# EAGLE board Filter Board (EAGLE 9.5.1)
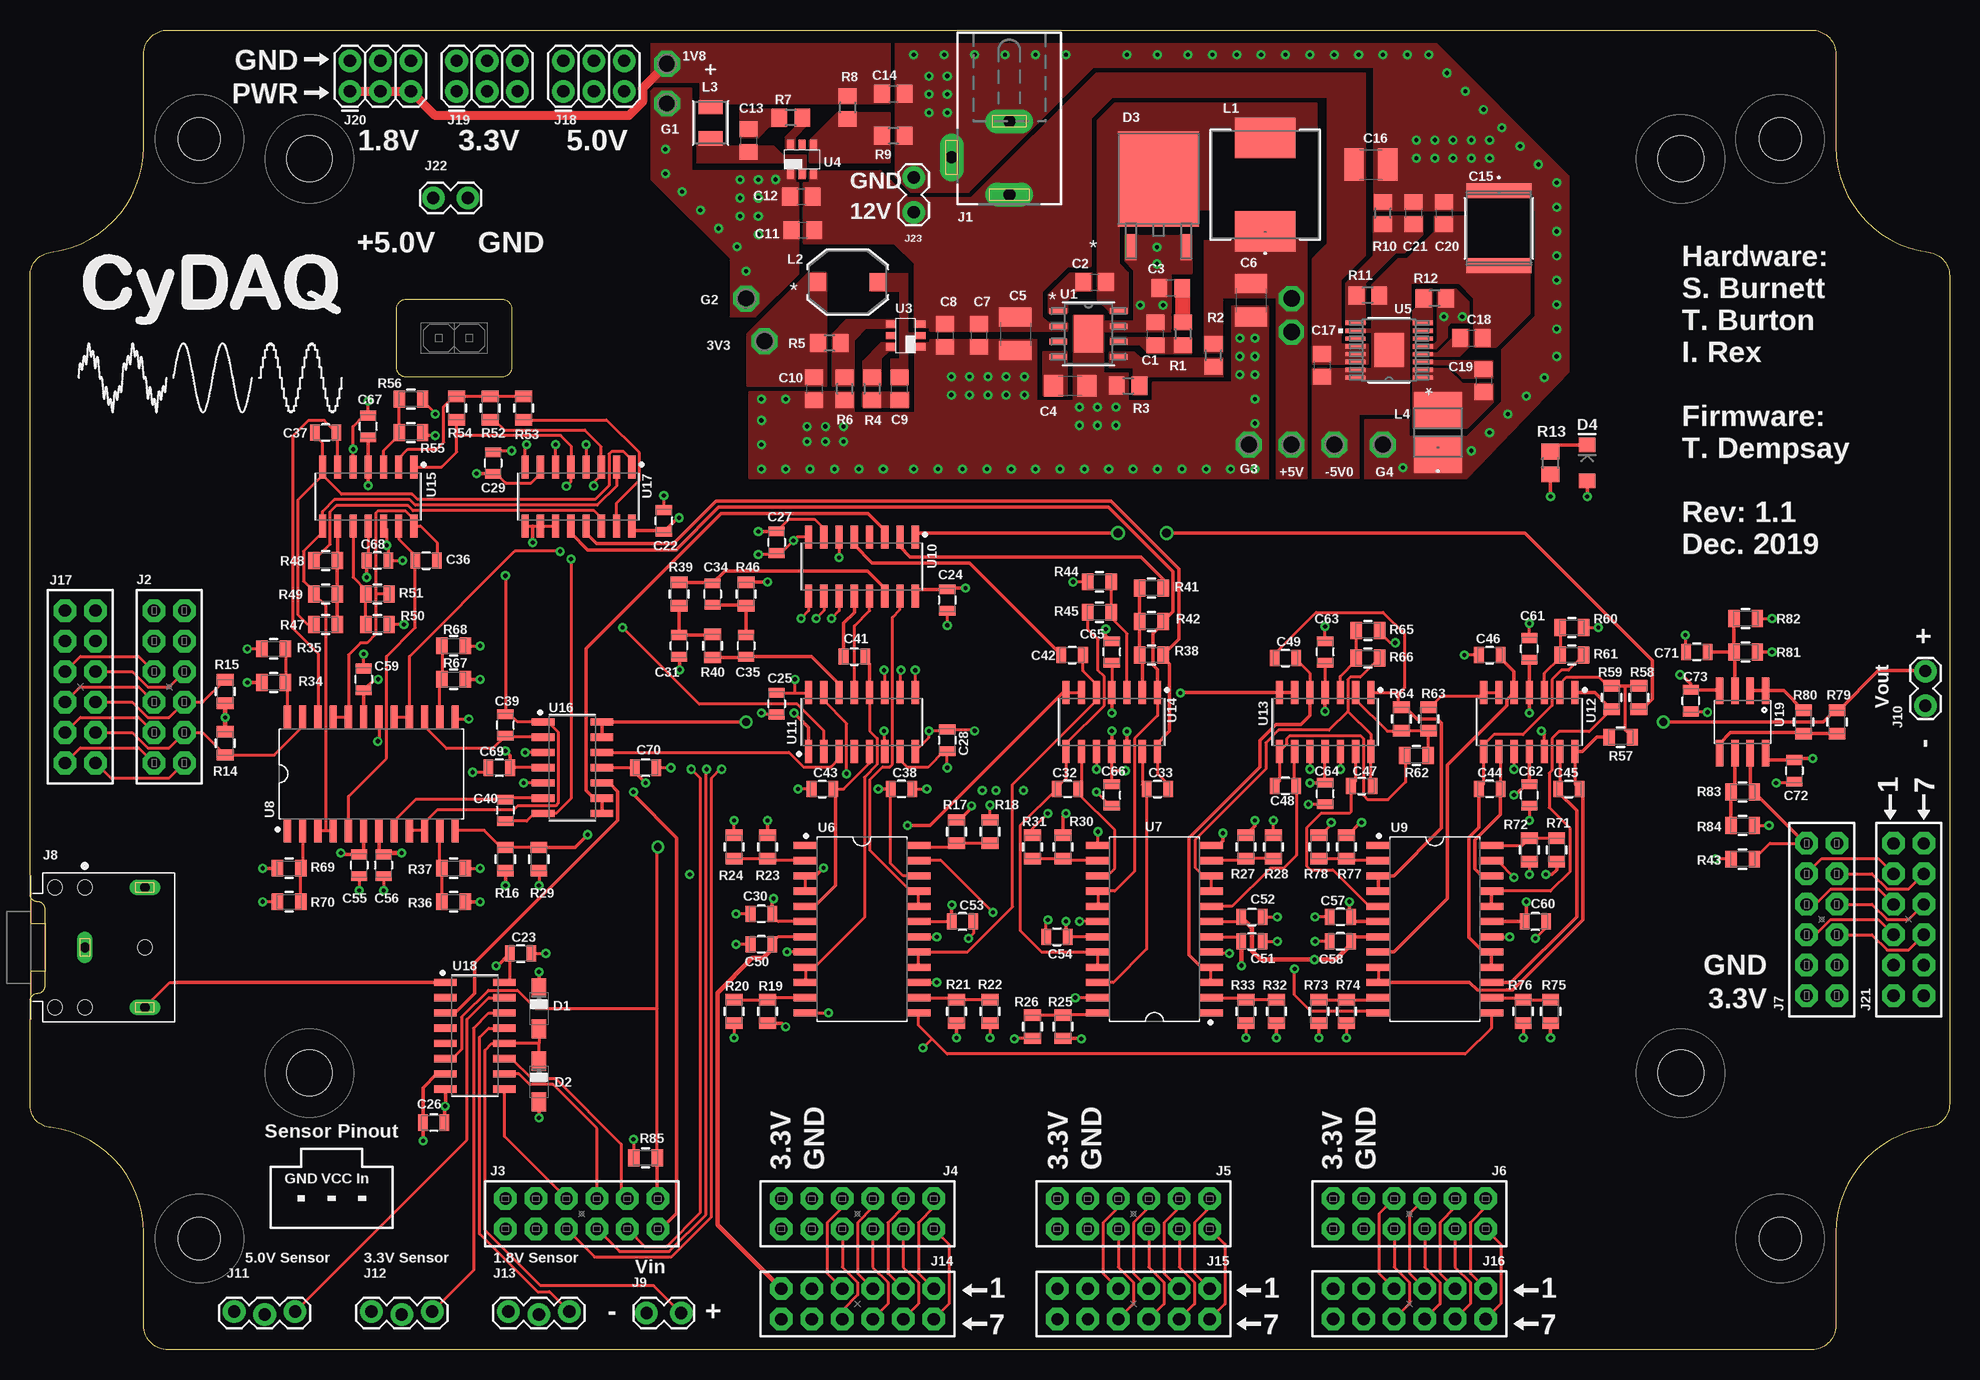
[diagram p5: board, top side]
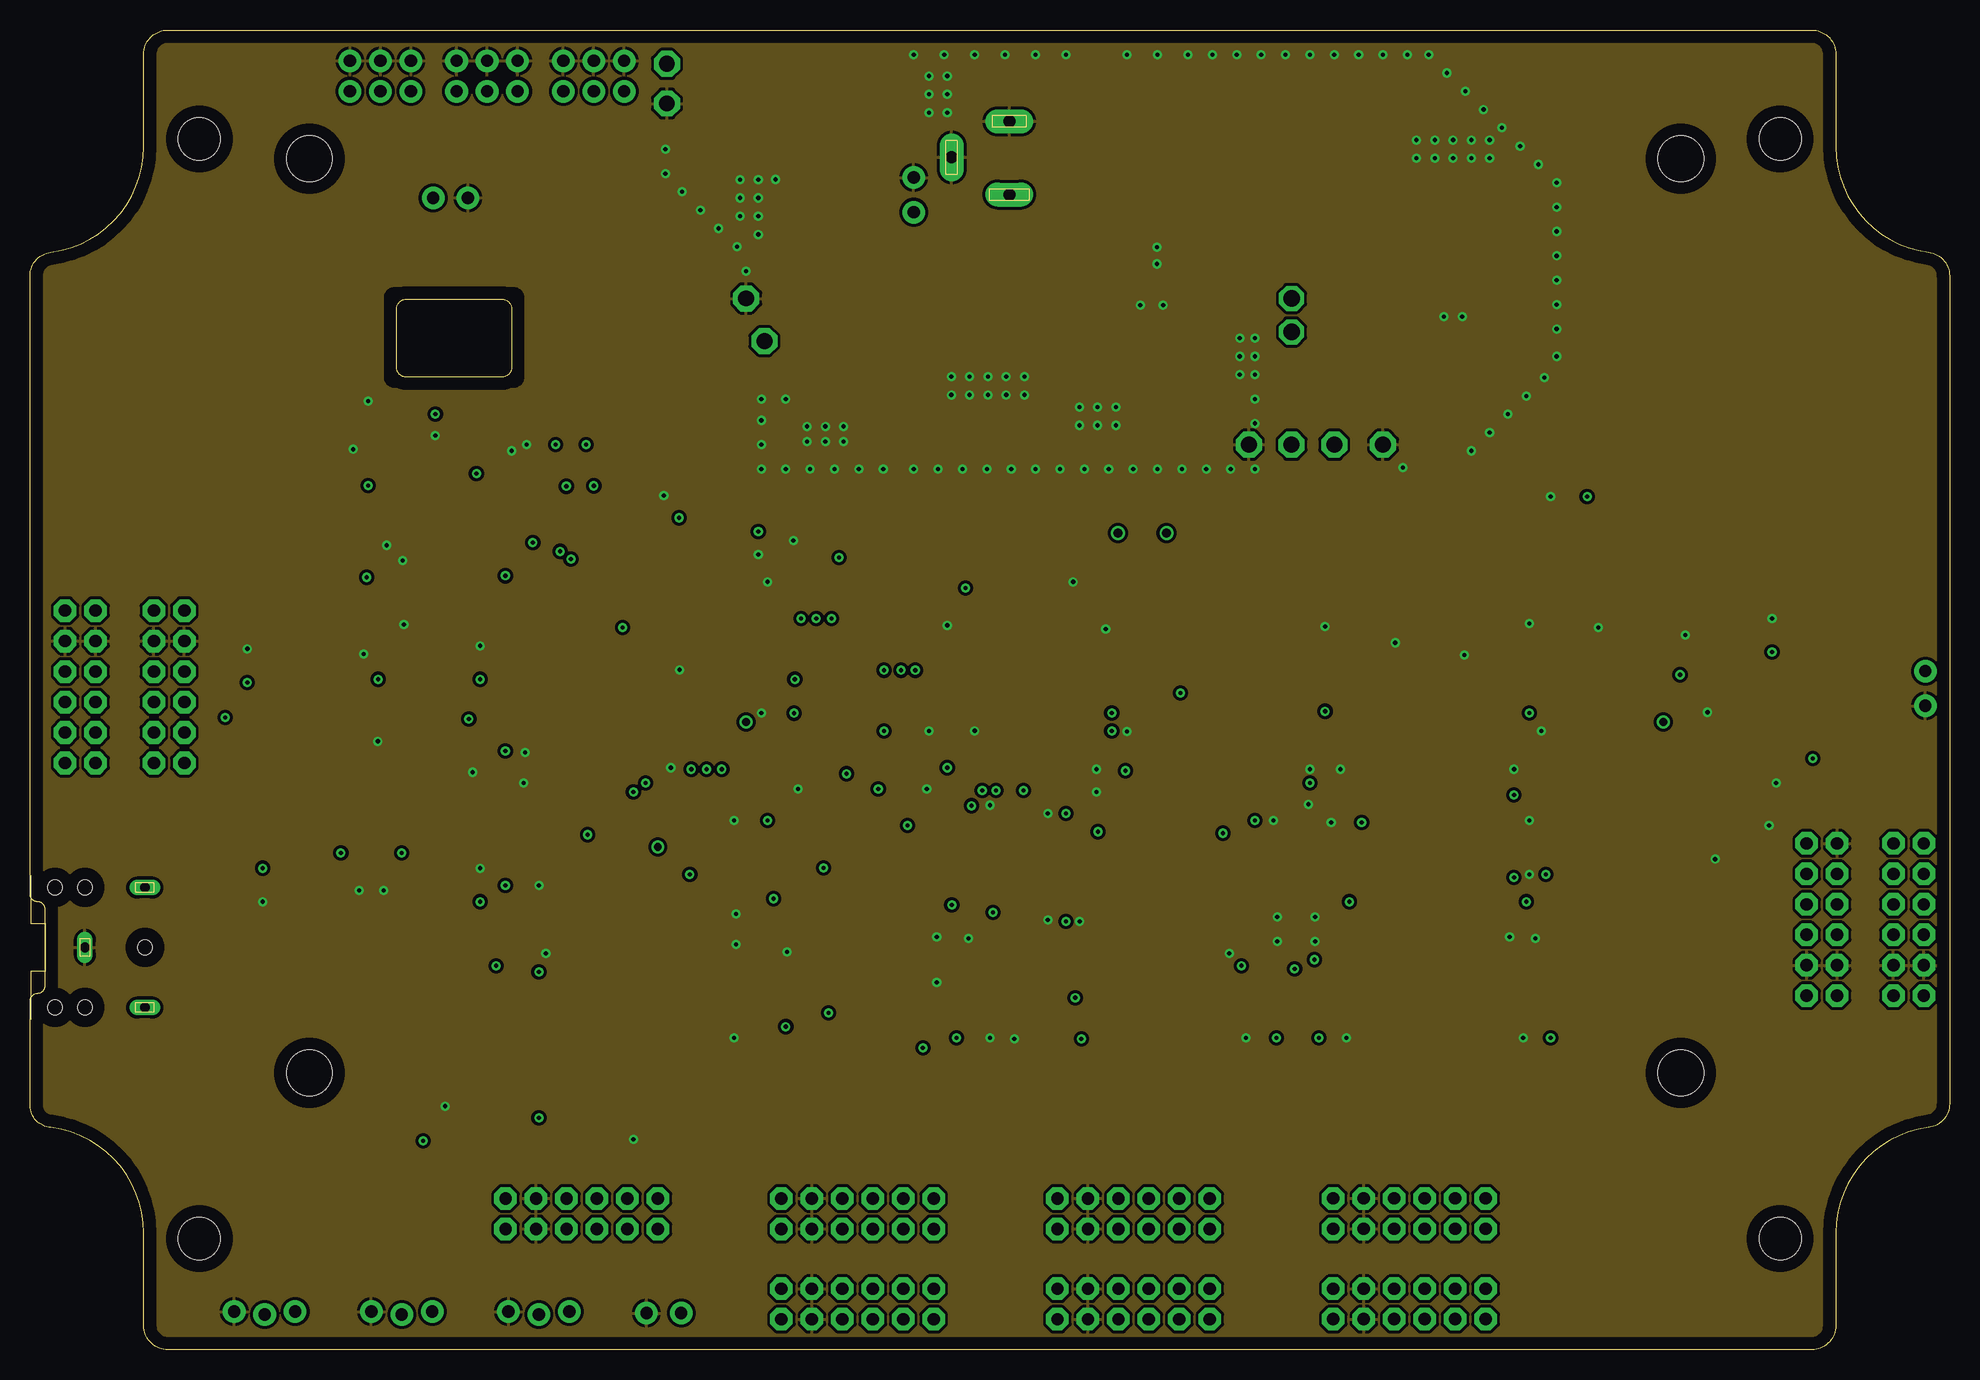
[diagram p6: board, inner layer Route2]
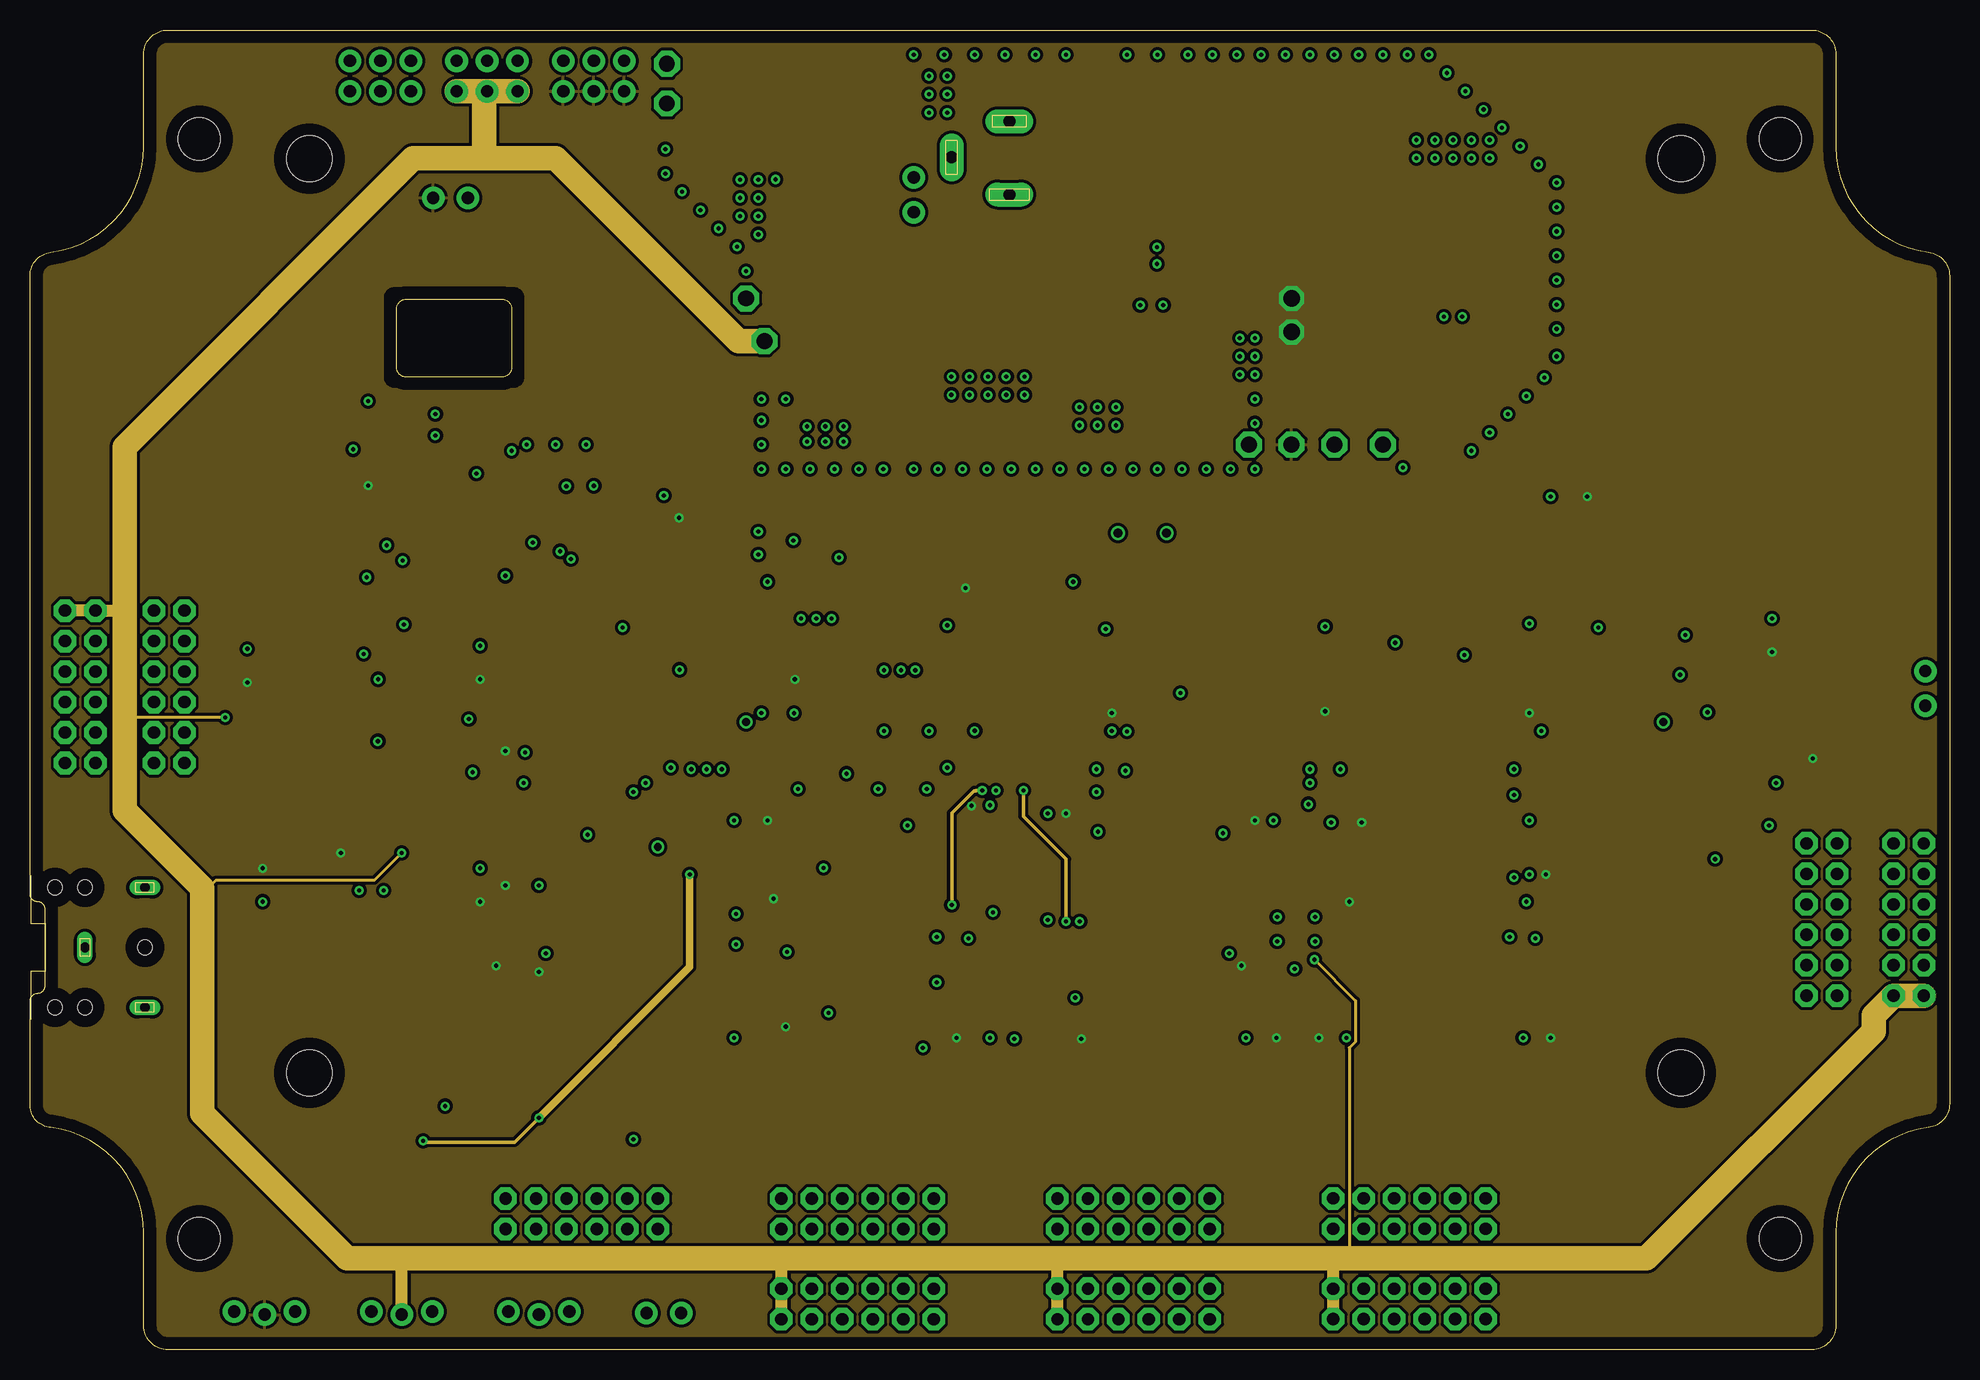
[diagram p7: board, inner layer Route15]
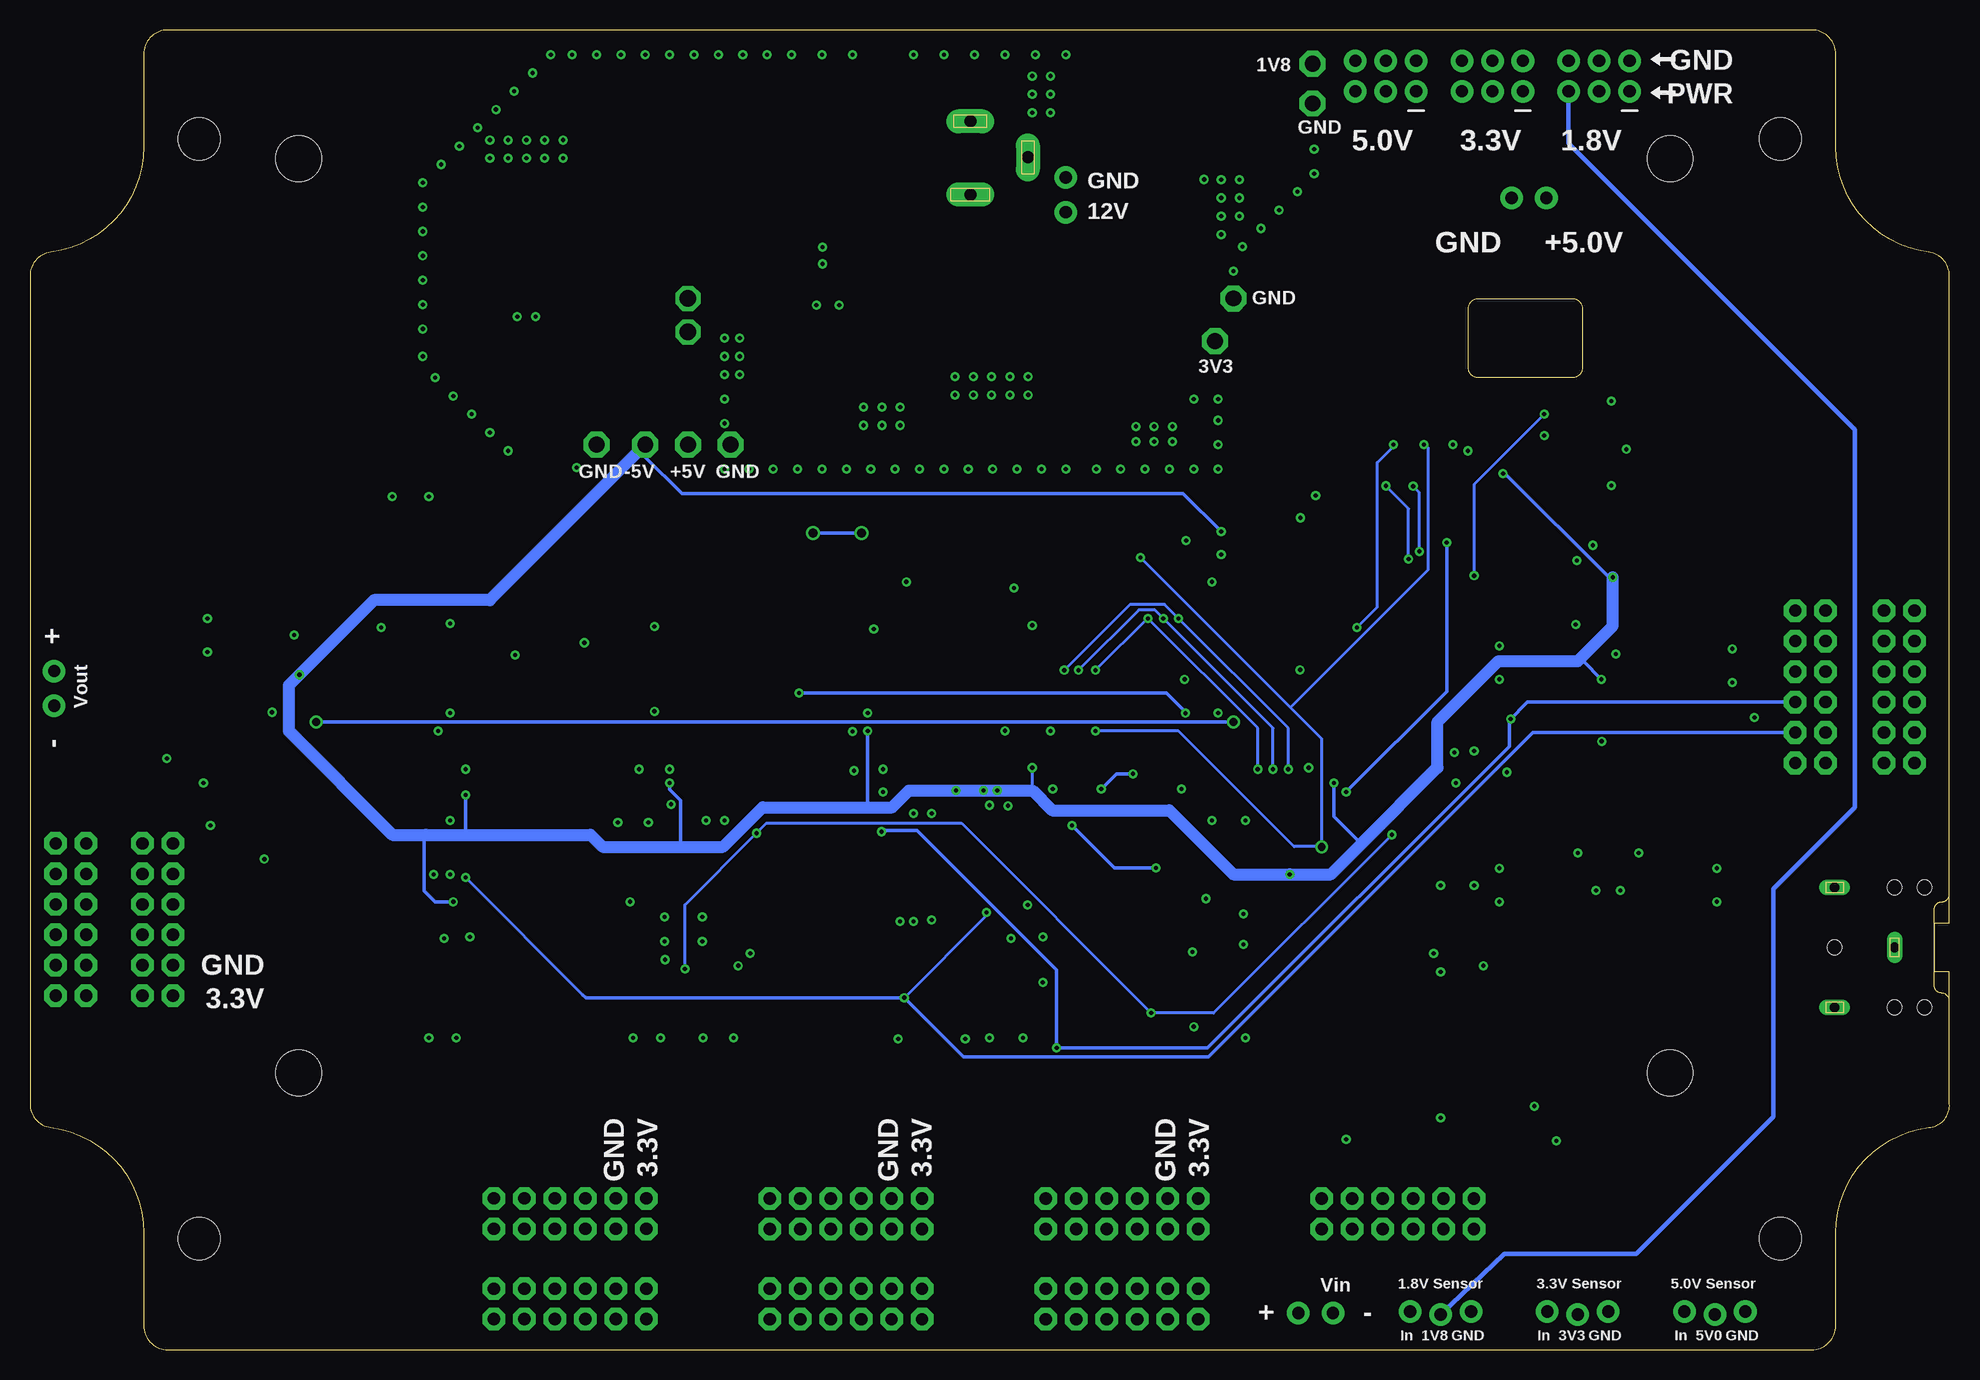
[diagram p8: board, bottom side, seen from below]

Size 160 x 110.01 mm. Coordinates in mm from the lower left corner, seen from the top.
Outline: 31.37,87.57 39.33,87.57 arc-90 40.14,86.75 40.14,81.88 arc-90 39.33,81.07 31.37,81.07 arc-90 30.56,81.88 30.56,86.75 arc-90 31.37,87.57
Outline: 0,29.08 arc-90 0.64,29.72 arc90 1.27,30.35 1.27,36.7 arc90 0.64,37.34 arc-90 0,37.97 0,89.51 arc-83 1.75,91.49 arc83 9.48,100.27 9.48,108.01 arc-90 11.48,110.01 148.52,110.01 arc-90 150.52,108.01 150.52,100.27 arc83 158.25,91.49 arc-83 160,89.51 160,20.5 arc-83 158.25,18.52 arc83 150.52,9.74 150.52,2 arc-90 148.52,0 11.48,0 arc-90 9.48,2 9.48,9.74 arc83 1.75,18.52 arc-90 0,20.5 0,29.08
Copper layers (1+2*15+16): Top 0.035mm / dielectric 1.5mm / Route2 0.035mm / dielectric 0.15mm / Route15 0.035mm / dielectric 0.2mm / Bottom 0.035mm
Design rules "default *": minimum track width 6mil, minimum drill 0.35mm, track to track 8mil, track to pad 8mil, pad to pad 8mil, via to via 8mil, smd to smd 6mil, copper to edge 40mil, drill to drill 6mil, minimum pad ring 10mil, minimum via ring 8mil, stop-mask expansion 4mil, vias tented up to drill 15mil, thermal gap 10mil
Net classes: 0 default: width 0.254 mm; 1 Power: width 0.254 mm, clearance 0.203 mm to class 0; 2 GND: width 0.254 mm, clearance 0.203 mm to class 0, clearance 0.254 mm to class 1
Holes 3.51 mm at 14.11,100.94 14.11,9.27 145.89,9.27 145.89,100.94
Holes 3.81 mm at 23.29,99.27 23.29,23.07 137.59,23.07 137.59,99.27

## Footprints (pad centres in the part's own frame; a part is rotated, then mirrored left to right if it is on the bottom)
P1-13 = drill 1.321 pad 2.159 octagon: TP 0,0
C0805 = smd 1.3 x 1.5: 1 -0.95,0; 2 0.95,0
C1206 = smd 1.6 x 1.8: 1 -1.4,0; 2 1.4,0
C1210 = smd 1.6 x 2.7: 1 -1.4,0; 2 1.4,0
CGA9N3X7R1_CAP_5750 = smd 1.25 x 5.41: 1 -3.124,0; 2 3.124,0
0805_H0.75 = smd 0.8 x 1.35: 1 -0.9,0; 2 0.9,0
SOD123 = smd 1.6 x 1.2: 1 -1.7,0; 2 1.7,0
DPAK-L = smd 0.889 x 2.184: 1 -2.29,-5.728; 3 2.29,-5.728 | smd 6.731 x 7.899: 2 0,-0.051
LED-1206 = smd 1.2 x 1.4: A -1.5,0; C 1.5,0
DCJ0202 = drill 1 pad 2 long: 1 0,3.1; 2 4.8,0; 3 0,-3
FEMALE_HEADER-2X6 = drill 1.016 pad 1.88 octagon: 1 0,0; 2 0,2.54; 3 2.54,0; 4 2.54,2.54; 5 5.08,0; 6 5.08,2.54; 7 7.62,0; 8 7.62,2.54; 9 10.16,0; 10 10.16,2.54; 11 12.7,0; 12 12.7,2.54
CUI_SJ1-3523N = drill 0.8 long: 1 0,0; 2 5,-5; 3 5,5 | hole 1.2: -2.5,5; 0,5; 5,0; -2.5,-5; 0,-5
1X02_LOCK = drill 1.016 pad 1.88: 1 -0.178,0; 2 2.718,0
1X03_LOCK = drill 1.016 pad 1.88: 1 0,0.127; 2 2.54,-0.127; 3 5.08,0.127
2X3 = drill 1.016 pad 1.88: 1 0,0; 2 0,2.54; 3 2.54,0; 4 2.54,2.54; 5 5.08,0; 6 5.08,2.54
IHLP-3232DZ_IND_IHLP-3232DZ = smd 3.4 x 5.055: 1 -3.891,0; 2 3.891,0
IND_5022 = smd 1.45 x 1.5: 1 -2.525,0; 2 2.525,0
IND_NLCV32TR = smd 1.194 x 2.007: 1 -1.295,0; 2 1.295,0
IFSC-1515A_IND_IFSC_1515AH = smd 3.007 x 4.013: 1 -1.859,0; 2 1.859,0
R0805 = smd 1.3 x 1.5: 1 -0.95,0; 2 0.95,0
0805 = smd 0.95 x 1.4: 1 -0.975,0; 2 0.975,0
DDA8_3P1X2P4-L = smd 1.473 x 0.483: 1 -2.515,1.905; 2 -2.515,0.635; 3 -2.515,-0.635; 4 -2.515,-1.905; 5 2.515,-1.905; 6 2.515,-0.635; 7 2.515,0.635; 8 2.515,1.905 | smd 2.4 x 3.1: EPAD 0,0
TSOT23-6_DDC = smd 0.6 x 0.8: 1 -0.95,-1.25; 2 0,-1.25; 3 0.95,-1.25; 4 0.95,1.25; 5 0,1.25; 6 -0.95,1.25
PWP16 = smd 1.676 x 0.356: 1 -2.819,2.275; 2 -2.819,1.625; 3 -2.819,0.975; 4 -2.819,0.325; 5 -2.819,-0.325; 6 -2.819,-0.975; 7 -2.819,-1.625; 8 -2.819,-2.275; 9 2.819,-2.275; 10 2.819,-1.625; 11 2.819,-0.975; 12 2.819,-0.325; 13 2.819,0.325; 14 2.819,0.975; 15 2.819,1.625; 16 2.819,2.275 | smd 2.464 x 2.819: 17 0,0
SOIC127P1030X250-25T200X300 = smd 2 x 0.6: 1 -4.705,6.985; 2 -4.705,5.715; 3 -4.705,4.445; 4 -4.705,3.175; 5 -4.705,1.905; 6 -4.705,0.635; 7 -4.705,-0.635; 8 -4.705,-1.905; 9 -4.705,-3.175; 10 -4.705,-4.445; 11 -4.705,-5.715; 12 -4.705,-6.985; 13 4.705,-6.985; 14 4.705,-5.715; 15 4.705,-4.445; 16 4.705,-3.175; 17 4.705,-1.905; 18 4.705,-0.635; 19 4.705,0.635; 20 4.705,1.905; 21 4.705,3.175; 22 4.705,4.445; 23 4.705,5.715; 24 4.705,6.985
SOIC127P600X144-16 = smd 1.901 x 0.599: 1 -2.455,4.445; 2 -2.455,3.175; 3 -2.455,1.905; 4 -2.455,0.635; 5 -2.455,-0.635; 6 -2.455,-1.905; 7 -2.455,-3.175; 8 -2.455,-4.445; 9 2.455,-4.445; 10 2.455,-3.175; 11 2.455,-1.905; 12 2.455,-0.635; 13 2.455,0.635; 14 2.455,1.905; 15 2.455,3.175; 16 2.455,4.445
SOIC127P600X144-14 = smd 1.901 x 0.599: 1 -2.455,3.81; 2 -2.455,2.54; 3 -2.455,1.27; 4 -2.455,0; 5 -2.455,-1.27; 6 -2.455,-2.54; 7 -2.455,-3.81; 8 2.455,-3.81; 9 2.455,-2.54; 10 2.455,-1.27; 11 2.455,0; 12 2.455,1.27; 13 2.455,2.54; 14 2.455,3.81
SO08 = smd 0.61 x 2.21: 1 -1.905,-2.616; 2 -0.635,-2.616; 3 0.635,-2.616; 4 1.905,-2.616; 5 1.905,2.616; 6 0.635,2.616; 7 -0.635,2.616; 8 -1.905,2.616

## Placement (x,y rotation side)
1V8  TPPAD1-13  [P1-13]  53.09,107.19 0 top
3V3  TPPAD1-13  [P1-13]  61.22,84.07 0 top
+5V  TPPAD1-13  [P1-13]  105.16,75.44 0 top
-5V0  TPPAD1-13  [P1-13]  108.71,75.44 0 top
C1  10pF  [C0805]  93.82,84.67 90 top
C2  100nF  [C0805]  88.74,88.99 0 top
C3  1.2nF  [C0805]  95.09,88.48 180 top
C4  8.2nF  [C1206]  86.71,80.35 0 top
C5  10uF  [C1210]  82.13,84.67 270 top
C6  47uF  [C1210]  101.77,87.46 270 top
C7  10uF  [C0805]  79.09,84.54 270 top
C8  100nF  [C0805]  76.29,84.54 270 top
C9  100nF  [C0805]  72.48,80.1 90 top
C10  22uF  [C0805]  65.37,80.1 270 top
C11  10uF  [C0805]  64.43,93.31 180 top
C12  100nF  [C0805]  64.3,96.1 180 top
C13  100nF  [C0805]  59.91,100.8 270 top
C14  22uF  [C0805]  71.97,104.69 0 top
C15  47uF  [CGA9N3X7R1_CAP_5750]  122.43,93.47 270 top
C16  22uF  [C1210]  111.76,98.81 0 top
C17  4.7uF  [C0805]  107.7,82.04 270 top
C18  2.2uF  [C0805]  120.14,84.33 0 top
C19  [C0805]  121.16,80.77 270 top
C20  4.7uF  [C0805]  117.86,94.74 270 top
C21  33pF  [C0805]  115.32,94.74 270 top
C22  0.1uF  [0805_H0.75]  52.83,69.09 90 top
C23  0.1uF  [0805_H0.75]  40.9,33.02 0 top
C24  0.1uF  [0805_H0.75]  76.46,62.48 270 top
C25  0.1uF  [0805_H0.75]  62.23,53.85 270 top
C26  0.1uF  [0805_H0.75]  33.66,18.92 180 top
C27  0.1uF  [0805_H0.75]  62.23,67.31 270 top
C28  0.1uF  [0805_H0.75]  76.46,50.8 270 top
C29  0.1uF  [0805_H0.75]  38.61,73.91 270 top
C30  0.1uF  [0805_H0.75]  60.96,36.32 180 top
C31  0.1uF  [0805_H0.75]  54.1,58.67 90 top
C32  10nF  [0805_H0.75]  86.49,46.74 180 top
C33  10nF  [0805_H0.75]  93.98,46.74 0 top
C34  0.1uF  [0805_H0.75]  56.9,62.99 270 top
C35  0.1uF  [0805_H0.75]  59.69,58.67 270 top
C36  10nF  [0805_H0.75]  33.02,65.79 0 top
C37  10nF  [0805_H0.75]  24.64,76.45 180 top
C38  10nF  [0805_H0.75]  72.65,46.74 180 top
C39  10nF  [0805_H0.75]  39.63,52.07 90 top
C40  10nF  [0805_H0.75]  39.63,44.96 270 top
C41  10nF  [0805_H0.75]  68.71,57.78 0 top
C42  10nF  [0805_H0.75]  86.87,57.91 0 top
C43  10nF  [0805_H0.75]  66.04,46.74 0 top
C44  10nF  [0805_H0.75]  121.67,46.74 180 top
C45  10nF  [0805_H0.75]  128.27,46.74 0 top
C46  10nF  [0805_H0.75]  121.67,57.91 0 top
C47  10nF  [0805_H0.75]  111,46.99 0 top
C48  10nF  [0805_H0.75]  104.65,46.99 180 top
C49  10nF  [0805_H0.75]  104.65,57.66 0 top
C50  0.1uF  [0805_H0.75]  60.96,33.78 180 top
C51  0.1uF  [0805_H0.75]  101.86,34.04 0 top
C52  0.1uF  [0805_H0.75]  101.86,36.07 0 top
C53  0.1uF  [0805_H0.75]  77.73,35.69 180 top
C54  0.1uF  [0805_H0.75]  85.6,34.42 0 top
C55  0.1uF  [0805_H0.75]  27.43,40.39 270 top
C56  0.1uF  [0805_H0.75]  29.47,40.39 270 top
C57  0.1uF  [0805_H0.75]  109.22,36.07 180 top
C58  0.1uF  [0805_H0.75]  109.22,34.04 180 top
C59  0.1uF  [0805_H0.75]  27.82,55.88 270 top
C60  0.1uF  [0805_H0.75]  125.48,35.69 180 top
C61  0.1uF  [0805_H0.75]  124.97,58.42 90 top
C62  0.1uF  [0805_H0.75]  124.97,46.23 90 top
C63  0.1uF  [0805_H0.75]  107.95,58.17 90 top
C64  0.1uF  [0805_H0.75]  107.95,46.35 90 top
C65  0.1uF  [0805_H0.75]  90.17,58.17 90 top
C66  0.1uF  [0805_H0.75]  90.17,46.23 90 top
C67  0.1uF  [0805_H0.75]  28.2,76.96 90 top
C68  0.1uF  [0805_H0.75]  28.96,65.79 180 top
C69  0.1uF  [0805_H0.75]  39.12,48.51 180 top
C70  0.1uF  [0805_H0.75]  51.31,48.51 180 top
C71  0.01uF  [0805_H0.75]  138.94,58.17 180 top
C72  0.1uF  [0805_H0.75]  147.07,48.26 270 top
C73  0.1uF  [0805_H0.75]  138.43,54.1 90 top
D1  SBR80520LT3G  [SOD123]  42.42,28.45 270 top
D2  SBR80520LT3G  [SOD123]  42.42,22.35 270 top
D3  VS-50WQ04FNPBFDPAK-L  [DPAK-L]  94.07,97.62 0 top
D4  GREEN  [LED-1206]  129.8,73.91 90 top
G1  TPPAD1-13  [P1-13]  53.09,103.89 0 top
G2  TPPAD1-13  [P1-13]  59.69,87.63 0 top
G3  TPPAD1-13  [P1-13]  101.6,75.44 0 top
G4  TPPAD1-13  [P1-13]  112.78,75.44 0 top
J1  DCJ0202  [DCJ0202]  81.63,99.4 180 top
J2  ZYBO_JF  [FEMALE_HEADER-2X6]  10.33,61.61 270 top
J3  ZYBO_JE  [FEMALE_HEADER-2X6]  39.64,10.06 0 top
J4  ZYBO_JD  [FEMALE_HEADER-2X6]  62.63,10.06 0 top
J5  ZYBO_JC  [FEMALE_HEADER-2X6]  85.64,10.06 0 top
J6  ZYBO_JB  [FEMALE_HEADER-2X6]  108.63,10.06 0 top
J7  A_XADC  [FEMALE_HEADER-2X6]  150.63,29.51 90 top
J8  SJ1-3523N  [CUI_SJ1-3523N]  4.57,33.53 0 top
J9  Vin_HEADER  [1X02_LOCK]  51.56,3.05 0 top
J10  Vout_HEADER  [1X02_LOCK]  157.99,56.39 270 top
J11  5V0_SENSOR  [1X03_LOCK]  17.02,3.05 0 top
J12  3V3_SENSOR  [1X03_LOCK]  28.45,3.05 0 top
J13  1V8_SENSOR  [1X03_LOCK]  39.88,3.05 0 top
J14  BRKOUT_JD  [FEMALE_HEADER-2X6]  62.63,2.54 0 top
J15  BRKOUT_JC  [FEMALE_HEADER-2X6]  85.64,2.54 0 top
J16  BRKOUT_JB  [FEMALE_HEADER-2X6]  108.63,2.55 0 top
J17  BRKOUT_JF  [FEMALE_HEADER-2X6]  2.92,61.61 270 top
J18  5V0_CONN  [2X3]  44.45,104.9 0 top
J19  3V3_CONN  [2X3]  35.56,104.9 0 top
J20  1V8_CONN  [2X3]  26.67,104.9 0 top
J21  BRKOUT_JD  [FEMALE_HEADER-2X6]  157.87,29.51 90 top
J22  ZYBO_Power  [1X02_LOCK]  36.32,96.01 180 top
J23  INPUT_PWR  [1X02_LOCK]  73.66,97.54 270 top
L1  IHLP-3232DZ_IHLP3232DZER4R7M11  [IHLP-3232DZ_IND_IHLP-3232DZ]  102.96,97.12 90 top
L2  4.7uH  [IND_5022]  68.16,88.99 0 top
L3  2.2uH  [IND_NLCV32TR]  56.73,102.27 270 top
L4  15uH  [IFSC-1515A_IND_IFSC_1515AH]  117.35,76.45 90 top
R1  [R0805]  96.1,84.67 270 top
R2  [R0805]  98.64,82.89 90 top
R3  [R0805]  91.53,80.35 0 top
R4  30  [R0805]  70.2,80.1 270 top
R5  30.9k  [R0805]  66.64,83.91 180 top
R6  10k  [R0805]  67.91,80.1 90 top
R7  30  [R0805]  63.41,102.7 180 top
R8  12.4k  [R0805]  68.16,103.54 90 top
R9  10k  [R0805]  71.97,101.18 180 top
R10  1000k  [R0805]  112.78,94.74 90 top
R11  255k  [R0805]  111.51,87.88 180 top
R12  100k  [R0805]  117.1,87.63 180 top
R13  470  [R0805]  126.75,73.91 90 top
R14  4.7k  [0805]  16.26,50.55 90 top
R15  4.7k  [0805]  16.26,54.86 270 top
R16  10k  [0805]  39.63,40.89 270 top
R17  10k  [0805]  77.22,43.18 90 top
R18  10k  [0805]  80.01,43.18 270 top
R19  10k  [0805]  61.47,28.19 270 top
R20  10k  [0805]  58.68,28.19 90 top
R21  10k  [0805]  77.22,28.19 270 top
R22  10k  [0805]  80.01,28.19 90 top
R23  10k  [0805]  61.47,41.91 90 top
R24  10k  [0805]  58.68,41.91 270 top
R25  10k  [0805]  86.11,26.92 270 top
R26  10k  [0805]  83.57,26.92 90 top
R27  10k  [0805]  101.35,41.91 90 top
R28  10k  [0805]  103.63,41.91 270 top
R29  10k  [0805]  42.42,40.89 90 top
R30  10k  [0805]  86.11,41.91 90 top
R31  10k  [0805]  83.57,41.91 270 top
R32  10k  [0805]  103.89,28.19 270 top
R33  10k  [0805]  101.35,28.19 90 top
R34  10k  [0805]  20.32,55.63 180 top
R35  10k  [0805]  20.32,58.42 0 top
R36  10k  [0805]  35.31,37.34 0 top
R37  10k  [0805]  35.31,40.13 180 top
R38  100k  [0805]  93.47,57.91 0 top
R39  39k  [0805]  54.1,62.99 270 top
R40  39k  [0805]  56.9,58.67 270 top
R41  100k  [0805]  93.47,63.5 180 top
R42  100k  [0805]  93.47,60.71 0 top
R43  10k  [0805]  142.75,40.89 0 top
R44  33k  [0805]  89.16,64.01 0 top
R45  100k  [0805]  89.16,61.47 180 top
R46  9.1k  [0805]  59.69,62.99 270 top
R47  100k  [0805]  24.64,60.45 180 top
R48  100k  [0805]  24.64,65.79 0 top
R49  100k  [0805]  24.64,62.99 180 top
R50  91k  [0805]  28.96,60.45 180 top
R51  100k  [0805]  28.96,62.99 0 top
R52  100k  [0805]  38.36,78.49 270 top
R53  100k  [0805]  41.15,78.49 90 top
R54  100k  [0805]  35.56,78.49 270 top
R55  160k  [0805]  31.75,76.45 180 top
R56  100k  [0805]  31.75,79.25 0 top
R57  100k  [0805]  132.59,51.05 180 top
R58  100k  [0805]  134.11,54.36 90 top
R59  100k  [0805]  131.83,54.36 270 top
R60  51k  [0805]  128.53,60.2 180 top
R61  100k  [0805]  128.53,57.91 0 top
R62  100k  [0805]  115.57,49.53 180 top
R63  100k  [0805]  116.59,52.58 270 top
R64  100k  [0805]  114.3,52.58 90 top
R65  51k  [0805]  111.51,59.94 180 top
R66  100k  [0805]  111.51,57.66 0 top
R67  10k  [0805]  35.31,55.88 0 top
R68  10k  [0805]  35.31,58.67 180 top
R69  10k  [0805]  21.59,40.13 180 top
R70  10k  [0805]  21.59,37.34 0 top
R71  10k  [0805]  127.26,41.66 270 top
R72  10k  [0805]  124.97,41.66 90 top
R73  10k  [0805]  107.44,28.19 270 top
R74  10k  [0805]  109.73,28.19 90 top
R75  10k  [0805]  126.75,28.19 270 top
R76  10k  [0805]  124.46,28.19 90 top
R77  10k  [0805]  109.73,41.91 90 top
R78  10k  [0805]  107.44,41.91 270 top
R79  18k  [0805]  150.62,52.32 90 top
R80  1.8k  [0805]  147.83,52.32 270 top
R81  18k  [0805]  143,58.17 0 top
R82  2k  [0805]  143,60.96 180 top
R83  1.8k  [0805]  142.75,46.48 180 top
R84  18k  [0805]  142.75,43.69 0 top
R85  10k  [0805]  51.31,16 180 top
U1  TPS54531DDARDDA8_3P1X2P4-L  [DDA8_3P1X2P4-L]  88.23,84.67 0 top
U3  TPS56339  [TSOT23-6_DDC]  72.99,84.54 90 top
U4  TPS56339  [TSOT23-6_DDC]  64.35,99.23 0 top
U5  LM43601PWPR  [PWP16]  113.29,83.31 180 top
U6  X9258  [SOIC127P1030X250-25T200X300]  69.34,35.05 0 top
U7  X9258  [SOIC127P1030X250-25T200X300]  93.73,35.05 180 top
U8  X9258  [SOIC127P1030X250-25T200X300]  28.45,48.01 90 top
U9  X9258  [SOIC127P1030X250-25T200X300]  117.1,35.05 0 top
U10  CD74HCT4051  [SOIC127P600X144-16]  69.34,65.28 270 top
U11  CD74HCT4051  [SOIC127P600X144-16]  69.34,52.32 90 top
U12  OPA4197  [SOIC127P600X144-14]  124.97,52.32 270 top
U13  OPA4197  [SOIC127P600X144-14]  107.95,52.32 270 top
U14  OPA4197  [SOIC127P600X144-14]  90.17,52.32 270 top
U15  OPA4197  [SOIC127P600X144-14]  28.2,71.12 270 top
U16  OPA4197  [SOIC127P600X144-14]  45.21,48.51 0 top
U17  CD74HCT4053  [SOIC127P600X144-16]  45.72,71.12 270 top
U18  CD74HCT4051  [SOIC127P600X144-16]  37.09,26.16 0 top
U19  OPA2197  [SO08]  142.75,52.32 180 top

## Tracks (layer width: path | path; a pad name or v marks a point on that pad's centre or on a via)
0.5V_REF
  Top 0.305: U19.2 U19.1 146.19,54.94 R80.1
1V8SENSOR_IN
  Top 0.254: U18.13 38.23,26.8 37.47,26.04 37.47,9.65 42.29,4.83 43.31,4.83 44.71,3.43 J13.3
3.5MM_IN
  Top 0.254: J8.2 11.65,30.61 12.19,30.61
  Top 0.305: 12.19,30.61 U18.1
3V3SENSOR_IN
  Top 0.254: U18.14 38.23,28.07 36.96,26.8 36.96,6.6 J12.3
5V0SENSOR_IN
  Top 0.254: J11.3 36.43,17.5 36.43,27.53 38.23,29.34 U18.15
!HP!/LP_TOGGLE  (via drill 0.35)
  Top 0.254: U17.11 U17.10 41.91,68.67 U17.9
  Top 0.305: J3.11 52.59,10.06 53.89,11.35 53.89,42.67 50.29,46.26 v50.29,46.48 | v41.91,67.27 41.91,68.67
  Bottom 0.305: v50.29,46.48 41.91,54.86 v41.91,67.27
!SYSTEM_EN  (via drill 0.35, 0.65)
  Top 0.254: U18.6 35.18,24.26 35.97,25.04 35.97,27.72 38.21,29.97 40.63,29.97 42.15,28.45 52.29,28.45 | U10.6 v67.44,66.04 | U17.6 v43.82,75.44 | R85.1 52.29,28.45 | 52.29,28.45 52.29,41.87 v52.33,41.91 | v71.18,51.56 71.18,49.94 U11.6
  Top 0.305: J3.12 52.29,12.65 R85.1
  Bottom 0.254: 54.93,53.53 52.33,50.93 v52.33,41.91 52.36,41.94 54.64,41.94 64.26,51.56 v71.18,51.56 | 54.93,53.53 v67.44,66.04 | v43.82,75.44 43.71,75.44 43.49,75.22 43.49,64.97 54.93,53.53
!WP  (via drill 0.35)
  Top 0.254: R29.2 R16.1 39.29,41.87 37.85,43.3 U8.12 | U9.12 111.76,28.07 111.64,28.19 106.78,28.19 105.41,29.56 v105.41,31.75 | U6.12 v66.55,28.07
  Top 0.305: R29.2 45.43,41.87 v46.48,42.93 | U7.12 99.07,42.04 99.44,42.41 v99.44,43.05
  Bottom 0.254: v105.41,31.75 105.41,37.08 v99.44,43.05 98.61,43.89 82.37,43.89 v66.55,28.07 61.34,28.07 v46.48,42.93
+1V8
  Top 0.762: 1V8.TP 51.06,105.16 51.06,104.02 49.91,102.87 33.78,102.87 J20.5 J20.3 J20.1
  Bottom 0.356: J20.5 31.75,100.58 7.88,76.71 7.88,45.21 14.69,38.4 14.69,19.42 26.11,8 37.09,8 J13.2
  pour Top (no thermals): 55.88,103.12 55.88,105.66 51.82,105.66 51.82,109.47 71.63,109.47 71.63,103.89 57.66,103.89 57.66,103.12
+3V3  (via drill 0.35)
  Top 0.254: U7.7 100.58,35.69 C52.1 | U6.7 62.37,34.42 61.86,33.91 C50.1
  Top 0.305: U9.7 110.38,34.42 110.12,34.16 C58.1 | U8.7 29.09,41.67 C56.1
  Top 0.356: R15.2 v16.26,52.7 R14.2 | C56.1 29.58,41.4 v30.99,41.4 | C50.1 61.86,33.4 61.1,32.64 60.2,32.64 57.31,29.75 57.31,10.4 J14.2 | C52.1 101.86,35.17 101.86,33.25 102.59,32.51 v107.06,32.51 108.85,32.51 110.12,33.78 C58.1
  Route15 0.254: v16.26,52.7 8,52.7 7.88,52.83 | v30.99,41.4 28.7,39.12 15.5,39.12 14.86,38.48 14.35,38.48 | v107.06,32.51 110.49,29.09 110.49,25.67 109.97,25.16 109.97,8.12 109.48,7.62
  Route15 1.016: J17.1 J17.2 7.76,61.61 7.88,61.72 | J12.2 30.99,7.62 | J14.1 J14.2 62.63,7.51 62.74,7.62 | J15.1 J15.2 85.64,7.4 85.85,7.62 | J16.1 J16.2 108.63,6.77 109.48,7.62
  Route15 2.032: 3V3.TP 59.06,84.07 43.82,99.31 37.85,99.31 | J21.1 J21.2 153.67,27.85 153.67,26.54 134.75,7.62 109.48,7.62 85.85,7.62 62.74,7.62 30.99,7.62 26.42,7.62 14.35,19.68 14.35,38.48 7.88,44.96 7.88,52.83 7.88,61.72 7.88,75.24 31.95,99.31 37.85,99.31 | J19.3 J19.5 | J19.1 J19.3 | J19.3 37.85,104.65 37.85,99.31
  pour Top (no thermals): 66.39,89.75 64.86,89.75 59.78,84.67 59.78,80.35 66.39,80.35
+5V0  (via drill 0.35, 1.4)
  Top 0.254: C63.1 U13.4 | U7.6 100.58,34.42 C51.1 | C65.1 U14.4 | 50.17,69.34 U17.16 | U16.4 C69.1 | U6.6 62.36,35.69 61.86,36.18 C30.1 | C23.1 40,30.81 39.8,30.61 U18.16 | C25.1 63.76,54.75 | 63.76,54.75 64.87,54.75 U11.16 | 63.76,54.75 v63.76,55.88
  Top 0.305: U9.6 110.25,35.69 110.12,35.81 C57.1 109.98,36.21 v109.98,37.34 | C61.1 U12.4 v124.97,53.09 | U8.6 27.82,41.67 C55.1 26.03,41.29 v25.91,41.4 | U17.16 50.17,68.41 50.29,68.28 52.74,68.28 C22.1 53.99,69.34 v54.1,69.34 | U10.16 73.79,63.33 73.84,63.38 C24.1 76.57,63.5 v77.98,63.5 | U19.8 144.66,49.15 144.67,49.16 C72.1 147.18,49.28 v148.59,49.28 | R21.2 v77.22,25.99 | R23.2 v61.47,44.12 | R16.2 v39.63,38.69 | R32.2 v103.89,25.99 | v102.11,44.12 102.11,43.65 R27.2 | R34.2 v18.12,55.63 | R69.2 v19.39,40.13 | R36.2 v37.51,37.34 | R67.2 v37.51,55.88 | R73.2 v107.44,25.99 | R75.2 v126.75,25.99 | D1.1 v42.42,31.48 | R81.2 v145.21,58.17 | C67.1 U15.4 v28.2,72.03 | C69.1 40.02,49.52 v39.63,49.91 | C23.1 38.98,32 v38.86,32 | R19.2 62.7,27.22 v62.99,26.92 | C30.1 61.86,37.48 v61.98,37.59 | U14.4 v90.17,53.09 | R17.2 77.47,44.16 78.49,45.17 v78.49,45.34 | R30.2 86.11,44.45 v86.36,44.7 | R77.2 109.86,42.88 110.91,43.94 v111,43.94 | U13.4 v107.95,53.21 | R71.2 127.26,39.99 126.87,39.6 v126.36,39.6 | R25.2 87.59,25.95 v87.63,25.91 | D4.A v129.8,71.12
  Top 0.356: C51.1 100.97,34.02 v100.97,32
  other vias: 105.16,84.84 105.16,87.63
  pour Top (no thermals): 100.42,92.42 97.88,92.42 97.88,83.15 99.41,83.15 99.41,87.72 103.89,87.76 103.89,72.64 106.43,72.64 106.43,92.46 105.41,92.46 105.48,94.83 100.42,94.83
  pour Route15 (isolate 0.254): 0.09,0.09 160.87,0.09 160.87,111.09 9.4,111.12 9.4,113.54 6.61,113.54 6.61,111.09 0.09,111.09
+12V
  pour Top (no thermals): 86.45,84.92 75.02,84.92 75.02,85.18 73.75,85.18 73.75,90.51 72.06,92.2 64.52,92.2 64.52,97.28 65.03,97.28 65.03,98.26 68.04,98.26 70.88,98.29 73.15,96.01 78.49,96.01 88.9,106.43 111.25,106.43 111.25,91.19 109.22,89.15 109.22,83.82 111.51,83.82 111.51,82.17 106.94,82.17 106.94,90.93 108.21,92.2 108.21,104.39 90.17,104.39 88.39,102.62 88.39,90.3 86.49,90.3 84.33,88.14 84.33,86.11 84.84,85.6 86.45,85.6
-5V0  (via drill 0.35)
  Top 0.254: C64.2 U13.11 | U7.19 C54.2 | C66.2 90.17,48.26 | 90.17,48.26 U14.11 | U15.11 28.2,65.92 C68.2 | U16.11 C70.2 | U6.19 C53.2 | v91.32,48.26 90.17,48.26 | 38.62,73.03 38.86,73.03 39.65,72.24 41.77,72.24 42.55,73.03 U17.7 | C27.1 63.26,69.24 65.39,69.24 66.17,68.45 U10.7 | U11.7 72.52,49.15 73.13,48.54 74.84,48.54 76.2,49.9 C28.2 v76.46,48.51
  Top 0.305: U9.19 121.93,35.81 122.43,35.81 122.56,35.69 C60.2 124.72,35.83 v124.72,37.34 | U12.11 C62.2 124.72,47.13 123.82,46.23 v123.7,46.23 | U8.19 C59.2 28.72,55.88 v29.02,55.88 | U19.4 140.78,55 C73.2 138.43,55.5 137.67,56.26 v137.54,56.26 | D2.2 v42.42,19.32 | C70.2 50.41,48.14 v51.31,47.24 | C68.2 28.06,64.4 v28.07,64.39 | v37.21,73.03 37.22,73.01 C29.2 38.62,73.03 | C27.1 v60.72,68.21 v60.71,68.2 | U14.11 v90.17,51.56 | C53.2 v76.83,37.07 v76.84,37.08 | C54.2 86.36,34.55 v86.36,35.69 | C64.2 107.94,47.24 v106.68,47.24 | U18.7 33.91,22.99 32.76,21.83 C26.2 32.76,17.41 v32.77,17.4
  Route15 0.305: v79.38,46.61 78.87,46.61 78.84,46.58 78.69,46.58 76.84,44.73 v76.84,37.08 | v86.36,35.69 86.36,40.89 82.81,44.45 v82.81,46.61 | v42.42,19.32 40.39,17.29 32.88,17.29 v32.77,17.4
  Route15 0.61: v42.42,19.32 54.99,31.89 v54.99,39.62
  Bottom 0.254: 76.46,46.61 v76.46,48.51
  Bottom 0.305: v29.02,55.88 30.54,57.4 30.99,57.4 | v51.31,47.24 51.31,44.45 49.02,42.16 | v28.07,64.39 28.42,64.39 37.05,73.03 v37.21,73.03 | v60.71,68.2 63.88,71.37 105.67,71.37 108.71,74.42 -5V0.TP | v90.17,51.56 90.17,45.21 | v106.68,47.24 106.68,46.7 105.77,45.79 105.77,41.93 105.79,41.91 | v123.7,46.23 123.7,42.93 | v124.72,37.34 126.24,37.34 127.13,38.23 127.13,42.8 127,42.93
  Bottom 1.016: -5V0.TP 121.67,62.48 131.32,62.48 v137.54,56.26 138.43,55.37 138.43,51.56 129.8,42.93 127,42.93 123.7,42.93 113.29,42.93 112.27,41.91 105.79,41.91 102.24,41.91 98.94,45.21 90.17,45.21 88.14,45.21 86.74,46.61 v82.81,46.61 v80.52,46.61 v79.38,46.61 76.46,46.61 74.81,44.96 65.03,44.96 59.69,39.62 v54.99,39.62 51.56,39.62 49.02,42.16 42.67,48.51 42.67,52.32 37.59,57.4 30.99,57.4 28.07,60.33 v28.07,64.39
  pour Top (no thermals): 106.94,81.79 111.89,81.79 111.89,84.84 109.73,84.84 109.73,85.09 111.89,85.09 111.89,88.77 114.05,90.93 114.81,90.93 117.1,93.22 117.1,94.49 124.97,94.49 124.97,86.36 122.18,83.57 120.4,83.57 120.4,87.63 119.13,88.9 115.06,88.9 115.06,86.87 114.94,86.74 114.94,77.98 110.75,77.98 110.75,72.64 106.94,72.64
ANALOGUE_IN
  Top 0.254: 42.42,25.53 U18.12 38.48,25.53 37.92,24.97 37.92,9.96 42.55,5.33 52,5.33 J9.2 | D2.1 42.42,25.53 | D1.2 42.42,25.53
BOOT
  pour Top (no thermals): 115.32,82.17 118.24,82.17 119.38,81.03 121.92,81.03 121.92,82.42 115.32,82.42
BP2_IN
  Top 0.305: C42.1 78.31,65.57 70.19,65.57 68.71,67.06 U10.5
BP2_OUT
  Top 0.254: U6.5 65.41,36.96 | C43.2 67.82,46.74 69.98,48.9 U11.5
  Top 0.305: 65.41,36.96 67.14,38.69 67.14,46.54 C43.2
BP6_HPOUT
  Top 0.254: C44.2 121.16,47.13 U12.8 121.16,50.42 122.02,51.28 124.45,51.28 126.87,53.69 126.87,55.86 127.66,56.64 128.23,56.64 R61.2
  Top 0.305: U9.16 U9.17 121.16,33.15 119.94,34.37 119.94,42.7 120.77,43.52 C44.2
BP6_IN  (via drill 0.75)
  Top 0.305: R58.1 134.37,53.38 135.22,54.23 135.22,57.44 124.59,68.07 v94.74,68.07 | v90.68,68.07 74,68.07
  Top 0.406: 74,68.07 73.79,67.86 U10.1
  Bottom 0.305: v94.74,68.07 v90.68,68.07
BP6_OUT  (via drill 0.35)
  Top 0.305: U13.6 U13.7 95.93,54.78 v95.89,54.74 | U11.1 64.9,51.85 v63.7,53.06
  Bottom 0.254: v63.7,53.06 63.7,53.15
  Bottom 0.305: v95.89,54.74 65.28,54.74 63.7,53.15
FB
  pour Top (no thermals): 111.25,85.47 109.73,85.47 109.73,88.9 112.02,91.19 112.02,94.49 116.08,94.49 116.08,92.96 114.56,91.44 113.79,91.44 111.25,88.9
FILT_SELECT0  (via drill 0.35)
  Top 0.254: J3.5 47.05,7.72 53.47,7.72 56.8,11.05 56.8,47.65 57.53,48.39 v57.66,48.39 | U10.11 67.44,61.59 v66.8,60.96 | v71.18,56.64 71.25,56.57 U11.11
  Bottom 0.254: v57.66,48.39 57.66,51.82 v66.8,60.96 66.86,60.96 v71.18,56.64
FILT_SELECT1  (via drill 0.35)
  Top 0.254: J3.7 49.14,8.18 53.28,8.18 56.34,11.24 56.34,48.39 v56.39,48.39 | U10.10 66.17,61.59 v65.53,60.96 | v72.59,56.64 72.52,56.57 U11.10
  Bottom 0.254: v56.39,48.39 56.39,51.82 v65.53,60.96 66.24,61.67 67.57,61.67 v72.59,56.64
FILT_SELECT2  (via drill 0.35)
  Top 0.254: J3.9 51.22,8.64 53.09,8.64 55.88,11.43 55.88,47.62 v55.12,48.39 | U10.9 64.9,61.59 v64.26,60.96 | v73.79,56.64 U11.9
  Bottom 0.254: v55.12,48.39 55.12,51.82 v64.26,60.96 65.43,62.13 68.31,62.13 v73.79,56.64
FILTER_IN
  Top 0.305: U18.3 35.44,28.07 37.08,29.71 37.08,32.24 48.98,44.13 48.98,46.55 48.26,47.26 48.26,47.37 47.8,47.37 U16.10
FILTER_OUT_BUFF  (via drill 0.65)
  Top 0.305: U16.13 U16.14 v59.69,52.32 | v136.15,52.32 136.16,52.34 149.5,52.34 150.46,53.3 R79.2 150.75,53.3 154.05,56.6 158.03,56.6 J10.1
  Bottom 0.305: v59.69,52.32 v136.15,52.32
GND  (via drill 0.35)
  Top 0.254: R35.1 v18.12,58.42 | R20.1 v58.68,25.99 | C63.2 v107.95,60.27 | R29.1 v42.42,38.69 | R70.1 v19.39,37.34 | R76.1 v124.46,25.99 | C46.1 v119.56,57.91 | R28.1 v103.63,44.12 | R33.1 v101.35,25.99 | R22.1 v80.01,25.99 | C59.1 v27.82,57.99 | C23.2 v43,33.02 | R18.1 v80.01,45.39 | R24.1 v58.68,44.12 | R37.1 v37.51,40.13 | R68.1 v37.51,58.67 | R74.1 v109.73,25.99 | C22.2 v52.83,71.19 | C24.2 v76.46,60.38 | C30.2 v58.86,36.32 | C61.2 v124.97,60.53 | C50.2 v58.86,33.78 | C51.2 v103.96,34.04 | C52.2 v103.96,36.07 | C55.2 v27.43,38.28 | C56.2 v29.47,38.28 | C57.2 v107.12,36.07 | C58.2 v107.12,34.04 | C62.1 v124.97,44.12 | v31.06,65.79 C68.1 29.86,66.92 v29.72,67.06 29.72,68.41 U15.12 | v28.2,79.07 C67.2 27.83,77.86 26.93,76.96 v26.93,75.06 U15.5 | C70.1 v53.42,48.51 | C69.2 37.84,48.13 v36.89,48.13 | C38.1 v74.75,46.74 | R44.1 v86.95,64.01 | v31.16,60.45 R50.1 | U16.3 v41.28,49.78 | R60.1 v130.73,60.2 | U6.8 v63.11,33.15 | U6.18 v75.58,34.42 | U6.15 v75.58,30.61 | R82.1 v145.21,60.96 | C71.2 137.98,58.23 v137.98,59.56 | R84.2 v144.96,43.69 | C73.1 138.5,53.14 v139.83,53.14 | U12.10 v123.7,48.39 | U13.12 v109.22,48.39 | U13.10 v106.68,48.39 | U14.10 v88.9,48.39 | U7.18 v87.49,35.69 | U7.5 98.56,33.02 v99.96,33.02 | U9.18 v123.33,34.42 | C60.1 126.38,35.19 v125.48,34.29 | U12.12 126.24,51.31 v125.99,51.56 | C72.2 146.95,47.24 v145.54,47.24 | C29.1 38.73,74.93 v40.13,74.93 | v33.78,76.2 32.98,76.2 R55.1 | U8.18 29.09,50.8 v29,50.71 | R85.2 50.34,17.48 v50.29,17.53 | R26.1 82.09,25.95 v82.04,25.91 | C53.1 78.63,34.68 v78.23,34.29 | C54.1 84.7,35.68 v84.84,35.81 | R31.1 83.57,43.43 v84.84,44.7 | v88.9,46.48 v88.9,46.47 90.05,45.33 C66.1 | v60.71,66.29 62.12,66.29 C27.2 62.6,66.41 v63.63,67.44 63.93,67.73 U10.8
  Top 0.254: R78.1 107.57,42.88 108.46,43.77 v108.46,43.94 | C64.1 106.57,45.45 v106.56,45.47 | R72.1 v124.97,39.62 | C65.2 89.66,59.57 v89.66,60.07 | R65.1 112.48,59.82 113.37,58.93 v113.79,58.93 | U16.5 v41.15,47.24 | R43.1 v140.46,40.89 | C43.1 v64.01,46.74 | U17.8 41.28,75.31 v41.4,75.44 | C25.2 61.1,52.95 v60.96,53.09 | U11.8 74.93,51.01 v74.93,51.56 76.32,51.56 C28.1 78.63,51.7 v78.74,51.59
  Top 0.305: C31.1 54.13,57.74 v54.13,56.67 | U14.12 v91.44,51.54 | R46.1 59.73,64.01 v61.47,64.01 | R13.1 v126.75,71.12 | C26.1 34.56,20.26 v34.6,20.3 34.63,20.33 U18.8
  other vias: 93.94,91.91 94.45,87.08 92.55,87.08 93.94,90.51 87.47,78.57 88.99,78.57 90.52,78.57 76.8,81.11 78.32,81.11 79.85,81.11 81.37,81.11 82.9,81.11 82.9,79.59 81.37,79.59 79.85,79.59 78.32,79.59 76.8,79.59 87.47,77.05 88.99,77.05 90.52,77.05 59.18,97.54 60.71,97.54 59.18,96.01 59.18,94.49 60.71,96.01 60.71,94.49 60.71,92.96 71.12,73.41 60.96,79.25 62.99,73.41 65.03,73.41 67.06,73.41 69.09,73.41 85.85,73.41 73.66,73.41 75.69,73.41 77.73,73.41 79.76,73.41 81.79,73.41 83.82,73.41 52.96,98.04 54.36,96.52 55.88,95 57.41,93.47 59.69,89.92 58.93,91.95 52.96,100.08 91.95,73.41 93.98,73.41 96.01,73.41 98.05,73.41 116.59,107.95 118.11,106.43 114.81,107.95 118.62,99.31 118.62,100.84 112.78,107.95 110.75,107.95 108.71,107.95 106.68,107.95 104.65,107.95 102.62,107.95 100.59,107.95 98.55,107.95 96.52,107.95 93.98,107.95 91.44,107.95 86.36,107.95 83.82,107.95 81.28,107.95 78.74,107.95 76.2,107.95 73.66,107.95 76.46,106.17 74.93,106.17 74.93,104.65 76.46,104.65 76.46,103.12 74.93,103.12 100.84,84.33 100.84,82.8 102.11,84.33 102.11,82.8 100.84,81.28 102.11,81.28 102.11,79.25 117.86,86.11 119.38,86.11 119.64,104.9 121.16,103.38 122.68,101.85 124.21,100.33 125.73,98.81 127.26,95.25 127.26,93.22 127.26,91.19 127.26,89.15 127.26,87.12 127.26,85.09 127.26,82.8 126.24,81.03 124.72,79.5 123.19,77.98 121.67,76.45 120.14,74.93 114.43,73.53 120.14,100.84 120.14,99.31 121.67,100.84 121.67,99.31 115.57,99.31 115.57,100.84 117.1,100.84 117.1,99.31 64.77,76.96 67.82,76.96 60.96,77.47 66.3,76.96 62.99,79.25 60.96,73.41 87.89,73.41 89.92,73.41 62.13,97.55 127.26,97.28 102.11,77.22 102.11,73.41 100.08,73.41 67.82,75.69 64.77,75.69 66.3,75.69 60.96,75.44
  pour Top (no thermals): 95.09,84.92 95.09,89.75 96.87,89.75 96.87,94.32 91.28,94.32 91.28,90.77 92.04,90 92.04,85.69 89.5,85.69 89.5,86.19 86.96,86.19 86.96,79.08 83.91,79.08 83.91,84.16 75.02,84.16 75.02,83.91 73.75,83.91 73.75,78.07 68.67,78.07 68.67,79.84 59.95,79.84 59.95,72.64 103.22,72.64 103.22,86.96 100.17,86.96 100.17,80.61 93.56,80.61 93.56,79.08 91.53,79.08 91.53,81.37 89.5,81.37 89.5,84.92
  pour Route2 (isolate 0.254, rank 2): 0.09,0.09 160.87,0.09 160.87,111.09 5.97,111.12 5.97,113.54 2.8,113.54 2.8,111.09 0.09,111.09
  pour Top (rank 2, no thermals): 72.14,109.47 72.14,97.79 73.41,96.52 78.23,96.52 88.65,106.93 112.02,106.93 112.02,95 125.48,95 125.48,86.11 122.68,83.31 122.68,78.99 119.76,76.07 114.94,76.07 114.94,77.47 111.25,77.47 111.25,72.64 119.76,72.64 128.27,81.53 128.27,97.79 116.59,109.47
  pour Top (rank 2, no thermals): 117.6,88.39 118.87,88.39 119.89,87.38 119.89,85.6 118.37,85.6 118.11,85.34 118.11,84.33 117.22,83.44 115.32,83.44 115.32,83.82 117.1,83.82 117.35,84.07 117.35,88.14
  pour Top (no thermals): 51.82,105.16 55.12,105.16 55.12,98.3 63.76,98.3 63.76,97.28 64.01,97.28 64.01,89.66 60.45,86.11 58.42,86.11 58.42,90.93 51.82,97.54
HP1_IN
  Top 0.305: C41.1 67.81,60.57 68.71,61.47 U10.12
HP1_OUT
  Top 0.254: U6.10 U6.9 65.41,31.88 69.54,36.01 69.54,47.72 70.61,48.79 70.61,50.42 70.61,50.96 69.98,51.59 U11.12
  Top 0.305: U11.12 69.98,57.15 69.61,57.52 C41.2
HP2_OUT1
  Top 0.254: U14.1 93.98,52.86 92.07,50.95 92.07,39.87 90.43,38.23 U7.16 U7.17
  Top 0.305: U14.1 93.98,56.7 93.62,57.06 93.62,59.71 94.45,60.54 R42.2 95.28,61.54 95.28,64.86 89.91,70.23 57.4,70.23 53.85,66.67 46.48,66.67 45.09,68.07 U17.12
HP2_OUT2
  Top 0.254: U17.2 48.9,72.01 47.29,70.4 32.11,70.4 31.65,70.86 25.37,70.86 24.39,69.87 U15.8 24.39,68.15 22.81,66.57 22.81,64.06 23.67,63.2 R49.2 24.64,62.02 24.64,43.3 | U8.3 24.64,43.3 | 24.64,43.3 U8.4
HP2_OUT3  (via drill 0.35)
  Top 0.254: U15.1 34.29,73.58 35.56,74.84 35.56,76.2 | U8.17 U8.16 31.63,57.78 40.4,66.56 44.18,66.56 v44.2,66.55 | v44.71,71.98 45.09,72.36 U17.5 45.09,75.34 44.23,76.2 35.56,76.2 | 35.56,76.2 R54.2
  Bottom 0.254: v44.2,66.55 44.2,71.47 v44.71,71.98
HP/LP2_IN1
  Top 0.305: R41.1 94.45,64.24 92.61,66.08 73.37,66.08 72.52,66.93 U10.2
HP/LP2_IN2
  Top 0.254: R48.1 25.03,67.15 25.03,69.87 25.56,70.4 31.47,70.4 31.92,69.94 47.02,69.94 47.63,69.34 U17.14
HP/LP2_IN3
  Top 0.254: U17.15 48.9,70.59 50.8,72.49 50.8,74.77 48.06,77.51 R53.1
HP/LP6_OUT  (via drill 0.35)
  Top 0.254: U11.2 66.17,51.59 63.94,53.82 55.79,53.82 v49.41,60.2 | v46.36,75.44 U17.4
  Bottom 0.254: v46.36,75.44 46.36,75.3 47.7,73.95 47.7,61.9 v49.41,60.2
INPUT_SELECT0
  Top 0.254: U18.11 40.15,24.26 41.85,22.55 43.87,22.55 49.29,17.14 49.29,13.11 J3.10
INPUT_SELECT1
  Top 0.254: J3.8 47.26,18.44 43.6,22.1 41.66,22.1 40.77,22.99 U18.10
INPUT_SELECT2
  Top 0.254: J3.6 39.54,17.77 U18.9
JB1
  Top 0.254: J6.12 121.33,11.86 120.06,10.59 120.06,6.36 J16.12
JB2
  Top 0.254: J6.10 118.79,11.86 117.52,10.59 117.52,6.36 J16.10
JB3
  Top 0.254: J6.8 114.98,11.33 114.98,6.36 J16.8
JB4
  Top 0.254: J6.6 112.44,11.33 112.44,6.36 J16.6
JB7
  Top 0.254: J6.11 122.6,8.79 122.6,3.81 J16.11
JB8
  Top 0.254: J6.9 118.79,6.88 120.06,5.61 120.06,3.81 J16.9
JB9
  Top 0.254: J6.7 116.25,6.88 117.52,5.61 117.52,3.81 J16.7
JB10
  Top 0.254: J6.5 113.71,6.88 114.98,5.61 114.98,3.81 J16.5
JC1
  Top 0.254: J5.12 98.34,11.85 97.07,10.58 97.07,6.35 J15.12
JC2
  Top 0.254: J5.10 95.8,11.85 94.53,10.58 94.53,6.35 J15.10
JC3
  Top 0.254: J5.8 93.26,11.85 91.99,10.58 91.99,6.35 J15.8
JC4
  Top 0.254: J5.6 90.72,11.85 89.45,10.58 89.45,6.35 J15.6
JC7
  Top 0.254: J5.11 99.61,8.79 99.61,3.81 J15.11
JC8
  Top 0.254: J5.9 95.8,6.88 97.07,5.61 97.07,3.81 J15.9
JC9
  Top 0.254: J5.7 93.26,6.88 94.53,5.61 94.53,3.81 J15.7
JC10
  Top 0.254: J5.5 90.72,6.88 91.99,5.61 91.99,3.81 J15.5
JD1
  Top 0.254: J4.12 75.33,11.85 74.06,10.58 74.06,6.35 J14.12
JD2
  Top 0.254: J4.10 72.79,11.85 71.52,10.58 71.52,6.35 J14.10
JD3
  Top 0.254: J4.8 70.25,11.85 68.98,10.58 68.98,6.35 J14.8
JD4
  Top 0.254: J4.6 67.71,11.85 66.44,10.58 66.44,6.35 J14.6
JD7\
  Top 0.254: J4.11 76.6,8.79 76.6,3.81 J14.11
JD8
  Top 0.254: J4.9 72.79,6.88 74.06,5.61 74.06,3.81 J14.9
JD9
  Top 0.254: J4.7 70.25,6.88 71.52,5.61 71.52,3.81 J14.7
JD10
  Top 0.254: J4.5 67.71,6.88 68.98,5.61 68.98,4.55 67.71,3.28 J14.5
JF7
  Top 0.254: J17.11 4.19,50.18 9.06,50.18 J2.11
JF8
  Top 0.254: J17.9 4.19,52.72 9.06,52.72 J2.9
KEEPOUT
  cutout Route2: 30.43,88.58 40.27,88.58 arc-90 41.16,87.69 41.16,81.07 arc-90 40.27,80.18 30.43,80.18 arc-90 29.55,81.07 29.55,87.69 arc-90
  cutout Route15: 30.43,88.58 40.27,88.58 arc-90 41.16,87.69 41.16,81.07 arc-90 40.27,80.18 30.43,80.18 arc-90 29.55,81.07 29.55,87.69 arc-90
LP1_IN
  Top 0.254: U6.20 U6.21 73.4,38.23 70,41.62 70,47.53 71.06,48.59 71.69,48.59 71.88,48.79 71.88,61.05 72.52,61.68 U10.15
LP1_OUT  (via drill 0.35)
  Top 0.254: U6.22 72.77,39.5 71.75,40.52 C38.2 | v68.07,48.01 68.07,52.2 66.17,54.1 U11.15
  Top 0.305: C38.2 v70.71,46.74
  Bottom 0.305: v70.71,46.74 69.44,48.01 v68.07,48.01
LP2_OUT1
  Top 0.254: C33.2 94.88,47.12 93.98,48.02 U14.14
  Top 0.305: U14.14 93.98,50.55 95,51.56 95,57.15 94.45,57.7 R38.2 95.79,59.25 95.79,65.07 90.12,70.73 57.19,70.73 53.64,67.18 47.25,67.18 46.36,68.07 U17.13
LP2_OUT2
  Top 0.254: R47.2 23.16,60.45 22.35,61.26 22.35,70.86 24.39,72.9 | 24.39,72.9 U15.7 24.39,75.56 23.74,76.21 C37.2 | U17.1 50.17,74.17 49.48,74.86 48.46,74.86 48.26,74.66 48.26,72.02 47.11,70.87 32.3,70.87 31.84,71.32 25.97,71.32 24.39,72.9
LP2_OUT3  (via drill 0.35)
  Top 0.254: C40.2 41.4,44.06 41.91,44.57 41.91,44.58 42.04,44.7 U16.7 42.81,44.76 43.9,44.76 45.09,45.94 v45.09,65.91 | v46.99,72.01 46.99,72.26 47.63,72.9 U17.3 47.62,75.27 46.23,76.66 39.55,76.66 38.7,77.51 R52.2
  Bottom 0.254: v45.09,65.91 45.09,70.1 v46.99,72.01
N$1
  Top 1.27: R1.1 96.1,88.41 C3.1
N$2
  pour Top (no thermals): 90.01,81.88 90.01,83.15 92.04,83.15 92.55,82.64 99.41,82.64 99.41,81.11 93.06,81.11 93.06,79.59 92.04,79.59 92.04,81.88
N$3
  pour Top (no thermals): 84.93,86.45 84.93,87.97 86.71,89.75 88.48,89.75 88.48,88.23 87.21,88.23 86.45,87.46 86.45,86.45
N$4
  pour Top (no thermals): 90.01,86.45 91.53,86.45 91.53,89.75 90.77,90.51 90.77,95.08 98.39,95.08 98.39,99.4 107.28,99.4 107.28,103.85 90.39,103.85 88.99,102.45 88.99,87.54 90.01,86.53
N$5
  pour Top (no thermals): 86.45,83.15 84.42,83.15 84.42,79.59 86.45,79.59
N$6
  pour Top (no thermals): 90.05,83.82 92.46,83.82 93.22,83.06 96.78,83.06 96.78,84.33 90.05,84.33
N$7
  pour Top (no thermals): 72.1,83.91 70.96,83.91 69.43,82.38 69.43,80.35 70.96,80.35 70.96,82.64 71.59,83.27 72.1,83.27
N$8
  pour Top (no thermals): 69.43,79.84 73.24,79.84 73.24,78.57 69.43,78.57
N$9
  pour Top (no thermals): 70.11,88.27 72.52,88.27 72.52,82.55 71.76,82.55 71.76,80.39 73.15,80.39 73.15,84.33 74.55,84.33 74.55,84.71 73.15,84.71 73.15,89.66 70.11,89.66
N$10
  pour Top (no thermals): 63.76,100.08 63.76,101.09 64.77,102.11 64.77,103.38 63.76,103.38 63.76,101.85 62.99,101.09 62.99,100.08
N$11
  pour Top (no thermals): 69.69,85.18 72.1,85.18 72.1,85.81 68.04,85.81 66.89,84.67 66.89,80.35 68.67,80.35 68.67,84.16
N$12
  pour Top (no thermals): 60.71,101.09 61.6,101.98 62.99,101.98 62.99,103.38 59.18,103.38 59.18,101.09
N$13
  pour Top (no thermals): 55.63,98.93 55.63,101.6 57.91,101.6 57.91,100.33 61.98,100.33 62.74,99.57 64.65,99.57 64.65,97.79 64.14,97.79 64.14,98.93
N$14
  pour Top (no thermals): 71.63,98.93 65.03,98.93 65.03,100.84 67.31,103.12 71.63,103.12
N$17
  Top 0.305: R39.2 C31.2 56.82,59.57 R40.1
N$18
  pour Top (no thermals): 115.32,83.06 117.35,83.06 118.62,84.33 118.62,85.09 119.89,85.09 119.89,83.57 119.13,82.8 115.32,82.8
N$21
  Top 0.305: C34.2 59.62,62.09 R46.2 C35.1
N$22
  Top 0.254: U6.16 U6.17 78.14,33.15 81.9,36.91 81.9,47.13 88.9,54.13 U14.5 88.9,55.46 87.77,56.59 C42.2
N$23  (via drill 0.35)
  Top 0.254: U14.7 U14.6 | U6.4 U6.3
  Top 0.305: U14.7 86.11,54.78 75.02,43.69 v73.15,43.69 | v66.15,40.16 65.49,39.5 U6.3
  Bottom 0.305: v73.15,43.69 69.62,40.16 v66.15,40.16
N$24
  Top 0.254: U12.2 127.51,55.5 128.07,56.06 130.76,56.06 131.49,55.33 R59.1 | R57.1 132.97,51.65 132.97,55.33
  Top 0.305: R59.1 132.97,55.33 R58.2
N$25
  Top 0.254: U14.3 91.44,59.69 90.13,61 R45.1 R44.2
N$26
  Top 0.305: U14.2 92.71,57.7 R38.1 R42.1 R41.2
N$27
  Top 0.254: R18.2 R17.1 76.92,41.91 74.93,41.91 74.81,42.04 U6.24
N$28
  Top 0.254: U14.9 87.63,46.98 C32.1 87.39,46.34 90.43,43.31 90.43,40.13 89.79,39.5 U7.15
N$29
  Top 0.254: U7.21 U7.20 84.33,33.15 82.54,34.94 82.54,43.69 C32.2 85.59,46.86 86.36,47.64 U14.8 86.36,50.52 89.54,53.7 89.54,56.1 89.03,56.61 89.03,59.18 88.18,60.03 R45.2
N$30
  Top 0.254: U14.13 92.71,47.11 C33.1 93.08,33.39 90.3,30.61 U7.22
N$31
  Top 0.254: R50.2 R51.1 27.98,63.33 26.93,64.39 U15.10
N$32
  Top 0.305: R47.1 R49.1 R48.2 25.66,65.83 U15.9
N$33
  Top 0.254: R20.2 R19.1 61.64,29.34 U6.11
N$34
  Top 0.254: U15.13 30.74,67.56 32.12,66.18 C36.1 32.12,60.19 29.73,57.79 29.73,49.3 26.55,46.12 U8.5
N$35
  Top 0.254: C36.2 33.92,67.3 32.56,68.67 U15.14 32.01,69.22 31.28,69.94 29.03,69.94 28.83,69.74 28.83,62.99 | U8.21 U8.20 26.55,57.91 27.55,58.91 28.09,58.91 28.83,59.65 28.83,62.99 | R51.2 28.83,62.99
N$36
  Top 0.254: U15.6 25.66,76.34 C37.1 24.54,77.46 23.2,77.46 21.9,76.15 21.9,60.15 24.01,58.04 U8.22
N$37
  Top 0.254: U15.3 29.47,74.93 30.78,76.24 R55.2 R56.1
N$38
  Top 0.254: U15.2 30.74,74.3 31.5,75.06 33.91,75.06 34.49,75.64 34.49,78.6 35.35,79.46 R54.1 R52.1 R53.2
N$39
  Top 0.254: R22.2 R21.1 77.05,29.34 U6.14
N$40
  Top 0.254: U16.2 39.74,51.05 C39.1 38.57,50.11 34.73,50.11 32.9,51.94 U8.15
N$41  (via drill 0.35)
  Top 0.254: U8.9 U8.10 32.9,43.94 33.95,45 40.31,45 40.65,45.34 43.84,45.34 44.04,45.54 44.04,51.49 43.21,52.32 U16.1 40.64,52.32 40,52.97 C39.2 v39.63,64.52 | R56.2 32.73,79.12 33.78,78.06 v33.78,77.98
  Bottom 0.254: v33.78,77.98 39.63,72.14 v39.63,64.52
N$42
  Top 0.254: U16.6 39.74,45.97 C40.1 32.14,45.86 30.36,44.07 U8.8
N$43
  Top 0.254: U11.3 67.44,49.28 66.75,48.59 64.46,48.59 63.27,49.78 U16.12
N$44
  Top 0.254: R24.2 R23.1 61.64,40.77 U6.2
N$45
  Top 0.254: R26.2 R25.1 88.86,27.9 U7.24
N$46
  Top 0.254: R28.2 R27.1 101.18,40.77 U7.11
N$47
  Top 0.254: R31.2 R30.1 86.28,40.77 U7.14
N$48
  Top 0.254: R32.1 R33.2 101.18,29.34 U7.2
N$49
  Top 0.254: R35.2 R34.1 21.47,55.46 U8.24
N$50
  Top 0.254: R36.1 R37.2 34.17,40.3 U8.11
N$51
  Top 0.254: R68.2 R67.1 34.17,55.71 U8.14
N$52
  Top 0.254: R70.2 R69.1 22.74,40.3 U8.2
N$53
  Top 0.254: R71.1 R72.2 124.38,42.04 U9.24
N$54
  Top 0.254: R73.1 R74.2 112.22,29.17 U9.11
N$55
  Top 0.254: R75.1 R76.2 124.29,29.34 U9.14
N$56
  Top 0.254: R78.2 R77.1 109.9,40.77 U9.2
N$57
  Top 0.254: U12.3 126.24,56.39 127.55,57.7 R61.1 R60.2
N$58
  Top 0.254: R59.2 129.98,51.53 127.46,51.53 126.87,50.95 126.87,48.28 126.64,48.06 126.64,45.19 128.34,43.5 128.34,39.82 126.75,38.23 U9.21
  Top 0.305: U9.20 U9.21 | U12.1 130.43,54.78 R59.2
N$59
  Top 0.254: U12.9 122.57,49.73 C44.1
  Top 0.305: C44.1 122.57,44.61 120.45,42.48 120.45,40.07 121.02,39.5 U9.22
N$60
  Top 0.305: R13.2 127.3,75.41 D4.C
N$61
  Top 0.254: U12.13 127.51,46.87 C45.1
  Top 0.305: C45.1 127.37,46.48 128.92,44.94 128.92,36.08 123.45,30.61 U9.15
N$62
  Top 0.254: U12.14 128.78,47.13 C45.2 | U9.9 U9.10 | 120.63,29.97 123.07,29.97
  Top 0.305: U12.14 129.42,49.87 130.6,51.05 R57.2 | C45.2 129.43,46.48 129.43,35.81 123.58,29.97 123.07,29.97 | U9.10 120,30.61 120.63,29.97
N$63
  Top 0.305: U9.8 113.67,33.15 118.15,37.63 118.15,48.75 123.09,53.68 123.09,54.16 U12.5 123.7,56.53 122.57,57.66 C46.2
N$64
  Top 0.254: U12.6 U12.7 121.16,54.44 117.6,54.44 116.72,53.55 R63.1
N$65
  Top 0.254: U13.2 110.5,54.2 113.14,51.56 114.26,51.56 R64.1 R63.2 116.55,51.56 R62.1
N$66
  Top 0.254: U13.3 109.22,56.13 110.53,57.45 R66.1 R65.2
N$67
  Top 0.254: U13.1 114.05,54.78 | 114.05,54.78 114.22,54.78 114.56,55.12 114.56,59.69 112.78,61.47 107.19,61.47 103.75,58.03 C49.1 | R64.2 114.05,53.81 114.05,54.78
  Top 0.305: R64.2 114.6,53.55 115.59,52.56 117.31,52.56 117.64,52.23 117.64,43.47 113.67,39.5 U9.3 U9.4
N$68
  Top 0.254: U13.13 110.49,47.38 C47.1 110.1,44.82 109.99,44.71 107.62,44.71 106.41,43.5 106.41,40.32 106.73,40 108.59,40 111.64,36.96 U9.5
N$69
  Top 0.254: R66.2 110.89,56.06 110.06,56.06 109.85,55.86 109.85,53.22 | U7.9 U7.10 97.79,39.5 97.1,40.19 97.1,42.47 103.02,48.39 103.02,50.59 104.07,51.64 108.27,51.64 109.85,53.22 | 109.85,53.22 111.76,51.31 U13.14 111.76,47.13 C47.2
N$70
  Top 0.254: U13.9 105.41,47.13 C48.1 105.55,41.21 104.47,40.13 103.38,40.13 100.21,36.96 U7.8
N$71
  Top 0.254: R62.2 114.66,49.47 114.66,47.32 113.2,45.86 111.49,45.86 111.13,46.22 111.13,50.95 110.9,51.18 105.01,51.18 104.78,50.96 104.78,50.51 U13.8 104.14,47.38 C48.2
N$72
  Top 0.254: C49.2 105.55,57.53 106.68,56.4 U13.5 | U7.3 U7.4
  Top 0.305: U13.5 106.68,52.88 105.92,52.12 103.87,52.12 102.54,50.79 102.54,48.59 96.62,42.67 96.62,32.92 97.67,31.88 U7.4
N$73
  Top 0.254: R43.2 145.04,42.21 J7.12
  Top 0.305: U19.7 143.39,46.82 R83.1 143.73,46.44 147.96,42.21 J7.12
N$74
  Top 0.305: R84.1 R83.2 142.12,46.82 U19.6
NOTCH_IN
  Top 0.305: U10.14 71.25,63.5 69.82,64.92 57.93,64.92 C34.1 56.82,63.97 R39.1
NOTCH_OUT
  Top 0.305: R40.2 59.62,57.7 C35.2 65.16,57.77 67.44,55.5 U11.14
PASSTHROUGH
  Top 0.254: U11.13 68.71,60.33 69.98,61.59 U10.13
PGOOD
  pour Top (no thermals): 115.32,85.34 115.32,86.61 115.57,86.87 115.57,88.39 116.84,88.39 116.84,85.34
SCL  (via drill 0.35)
  Top 0.254: J17.10 8.53,51.45 9.8,50.18 11.6,50.18 J2.10 14.38,51.45 R14.1 20.36,49.57 22.74,51.94 U8.23 | U9.23 122.3,40.77 v123.7,39.37 | U7.23 v87.12,29.34 | v80.27,36.45 75.95,40.77 U6.23
  Bottom 0.254: v123.7,39.37 113.92,29.59 | v80.27,36.45 80.27,36.2 v87.12,29.34
  Bottom 0.305: J2.10 34.74,51.45 61.78,24.41 82.2,24.41 v87.12,29.34 113.67,29.34 113.92,29.59
SDA  (via drill 0.35)
  Top 0.254: J17.8 8.53,53.99 9.8,52.72 11.6,52.72 J2.8 14.41,53.99 R15.1 | U9.13 121.8,26.8 119.64,24.64 76.46,24.64 75.19,25.91 | 75.19,25.91 74.05,27.05 U6.13 | U7.13 v89.02,43.17 v89.03,43.18 | 75.19,25.91 v74.42,25.15 | U8.13 35.57,52.58 v36.58,52.58
  Bottom 0.254: v36.58,52.58 36.71,52.45
  Bottom 0.305: J2.8 35.17,53.99 36.71,52.45 36.71,50.29 61.85,25.15 v74.42,25.15 74.42,31.64 86.06,43.28 88.93,43.28 v89.03,43.18
SW
  pour Top (no thermals): 115.32,76.83 115.32,81.79 118.11,81.79 119.38,80.52 121.92,80.52 121.92,78.99 119.76,76.83
UART0_RX
  Top 0.254: J17.7 4.19,55.26 9.06,55.26 J2.7
UART0_TX
  Top 0.254: J17.5 4.19,57.8 9.06,57.8 J2.5
UART1_RX
  Top 0.254: J17.12 6.73,47.64 11.6,47.64 J2.12
UART1_TX
  Top 0.254: J17.6 8.53,56.53 9.8,55.26 11.6,55.26 J2.6
VIN_BUFFERED
  Top 0.305: U16.8 U16.9 46.99,45.97 46.36,46.6 46.36,55.11 46.36,55.12 46.36,58.46 57.61,69.72 69.86,69.72 71.25,68.33 U10.3
XADC_J14
  Top 0.254: J7.5 153.53,34.59 154.8,33.32 156.6,33.32 J21.5
XADC_J16
  Top 0.254: J7.7 153.53,37.13 154.8,35.86 156.6,35.86 J21.7
XADC_K14
  Top 0.254: J7.6 148.83,34.59 150.1,35.86 154.06,35.86 J21.6
XADC_K16
  Top 0.254: J7.8 148.83,37.13 150.1,38.4 154.06,38.4 J21.8
XADC_L14
  Top 0.254: J7.10 149.36,40.94 154.06,40.94 J21.10
XADC_L15
  Top 0.254: J7.9 153.53,39.67 154.8,38.4 156.6,38.4 J21.9
XADC_N1
  Top 0.305: C71.1 R81.1 | R82.2 R81.1 | U19.3 142.12,58.08 R81.1
XADC_N15
  Top 0.305: U19.5 140.85,50.55 141.73,51.44 147.58,51.44 147.66,51.35 R80.2 R79.1

## Text on the board
tPlace: GND | PWR | 1.8V | 3.3V | 5.0V | GND | 12V | +5.0V | GND | Hardware: / S. Burnett / T. Burton / I. Rex / / Firmware: / T. Dempsay / / Rev: 1.1 / Dec. 2019 | + | Vout | - | 1 | 7 | GND | 3.3V | Sensor Pinout | GND | VCC | In | 3.3V | GND | 3.3V | GND | 3.3V | GND | 5.0V Sensor | 3.3V Sensor | 1.8V Sensor | Vin | - | + | 1 | 1 | 1 | 7 | 7 | 7
bPlace: 1V8 | GND | PWR | GND | 1.8V | 3.3V | 5.0V | GND | 12V | +5.0V | GND | GND | 3V3 | GND | +5V | -5V | GND | + | Vout | - | GND | 3.3V | 3.3V | GND | 3.3V | GND | 3.3V | GND | Vin | 5.0V Sensor | 3.3V Sensor | 1.8V Sensor | - | + | GND | 5V0 | In | GND | 3V3 | In | GND | 1V8 | In